# EasyEDA Pro project Mainboard.epro

# Schematic Schematic2

## Sheets
1 AUDIO: Board Name: Mainboard; Create Date: 2025-11-27; Page Name: AUDIO; Project Name: esp32PhoneV2-retry; Schematic Name: Schematic2; Update Date: 2025-12-29; Company: EasyEDA.com; Page Size: A4; Version: V1.0
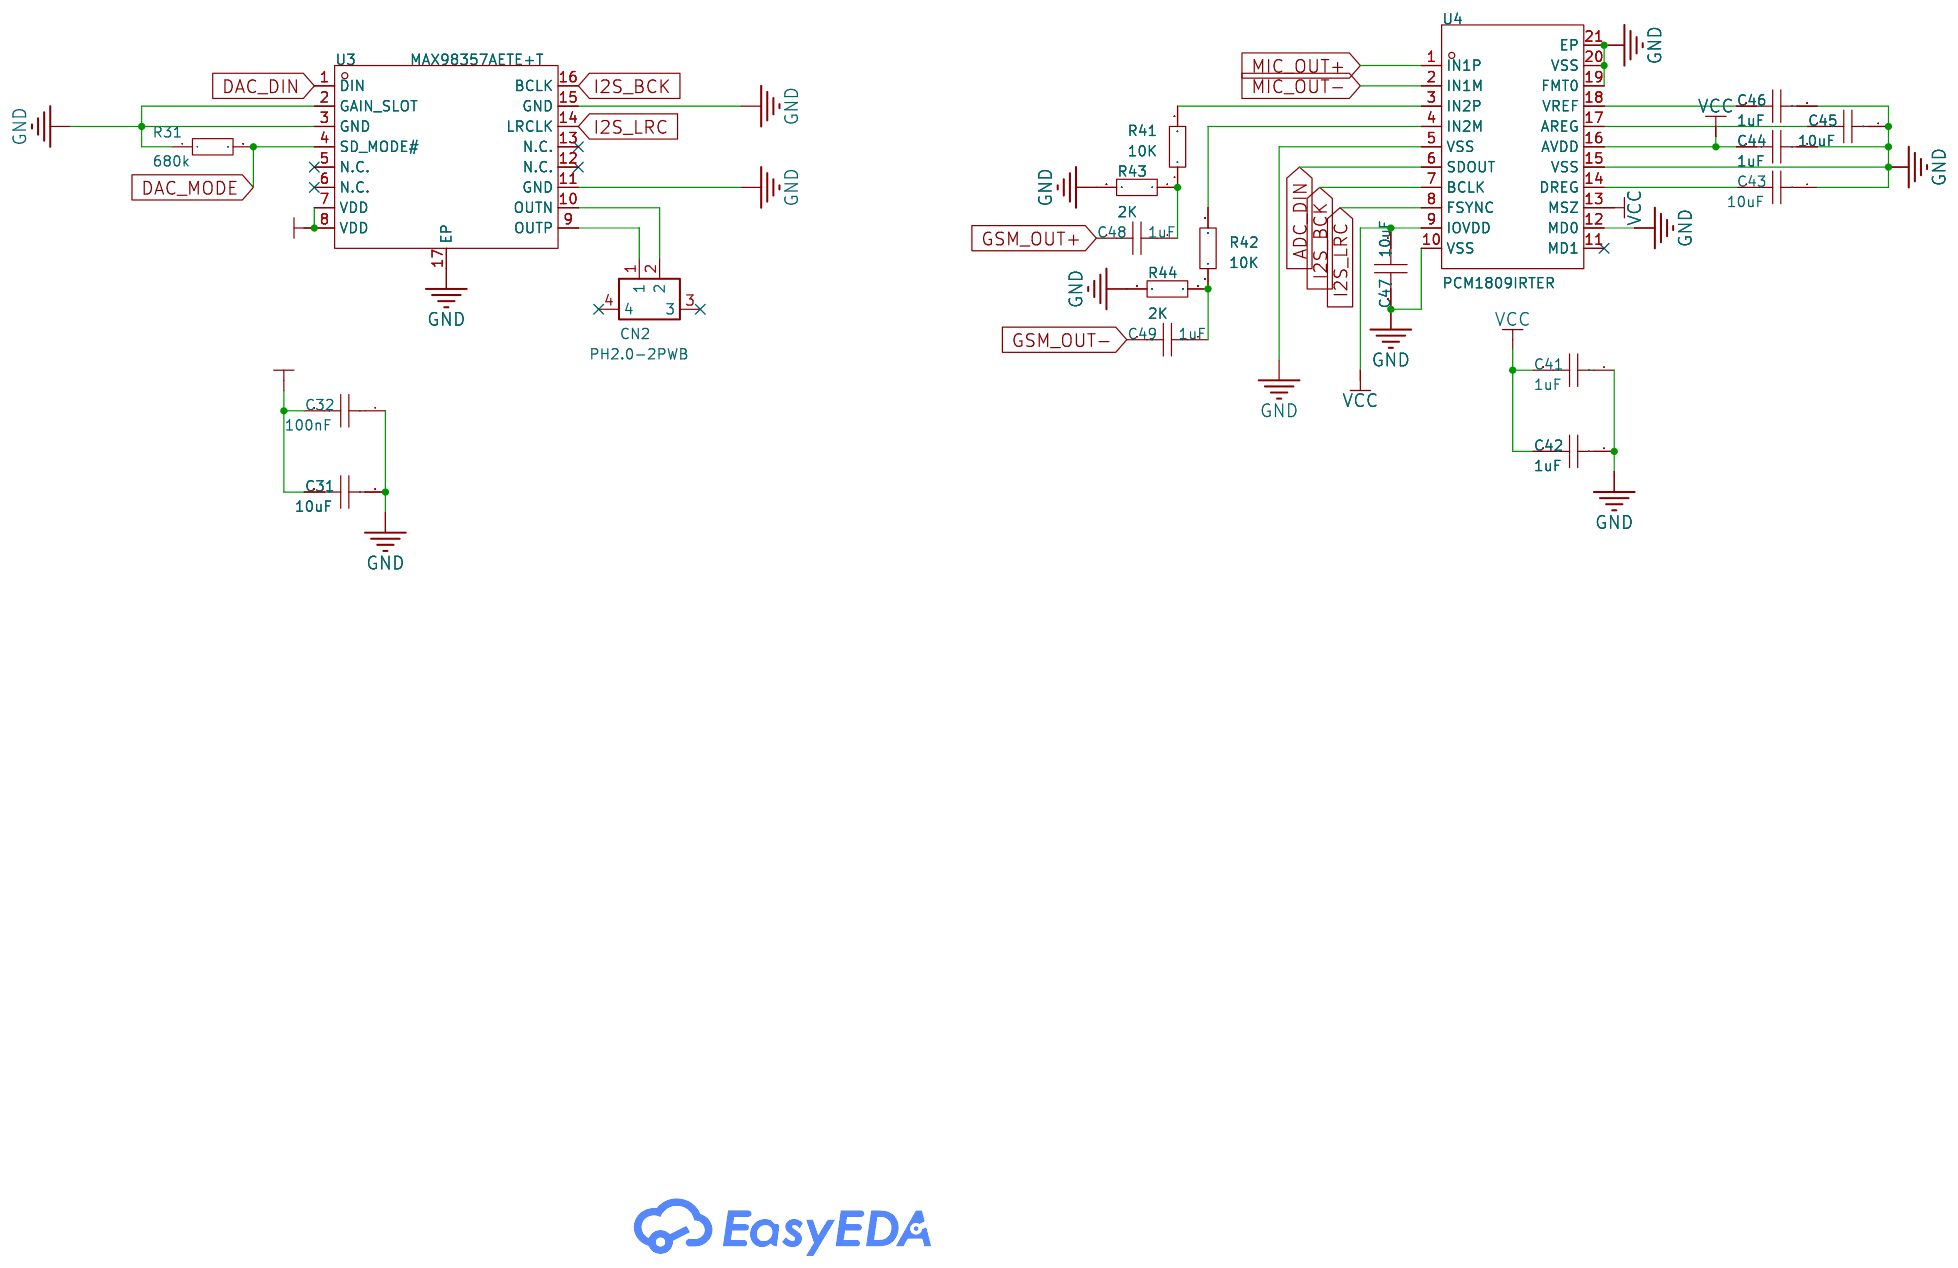
[diagram p0: AUDIO]
2 MAIN: Create Date: 2025-12-04; Page Name: MAIN
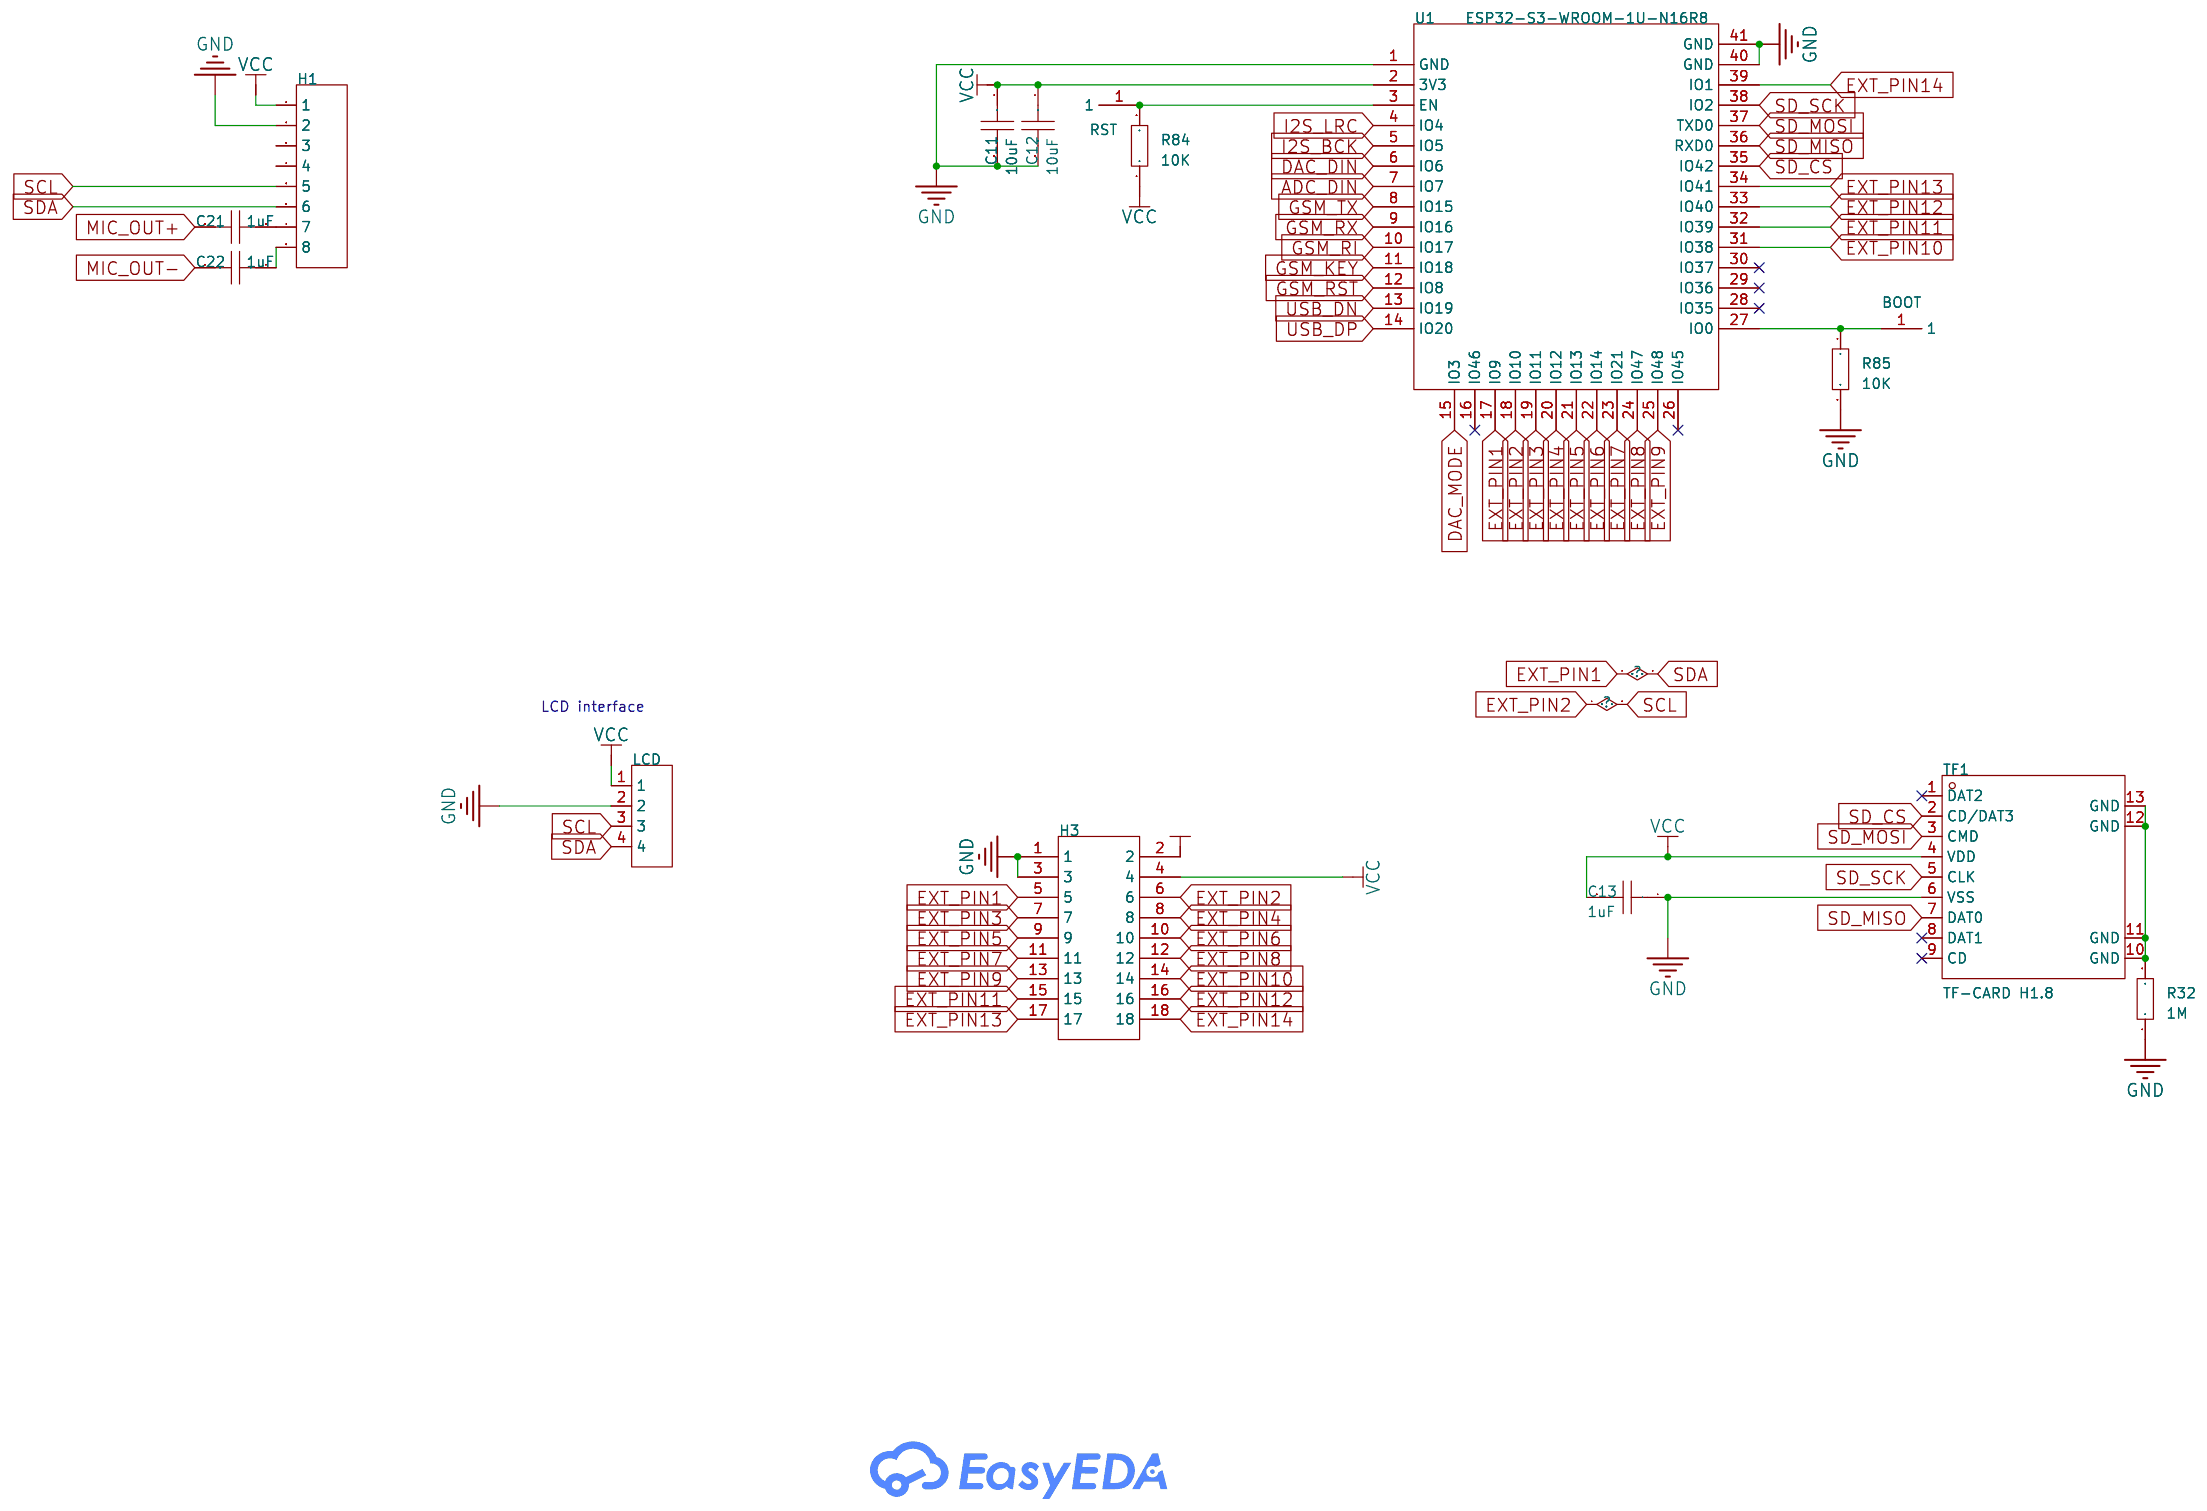
[diagram p1: MAIN]
3 GSM: Create Date: 2025-12-18; Page Name: GSM
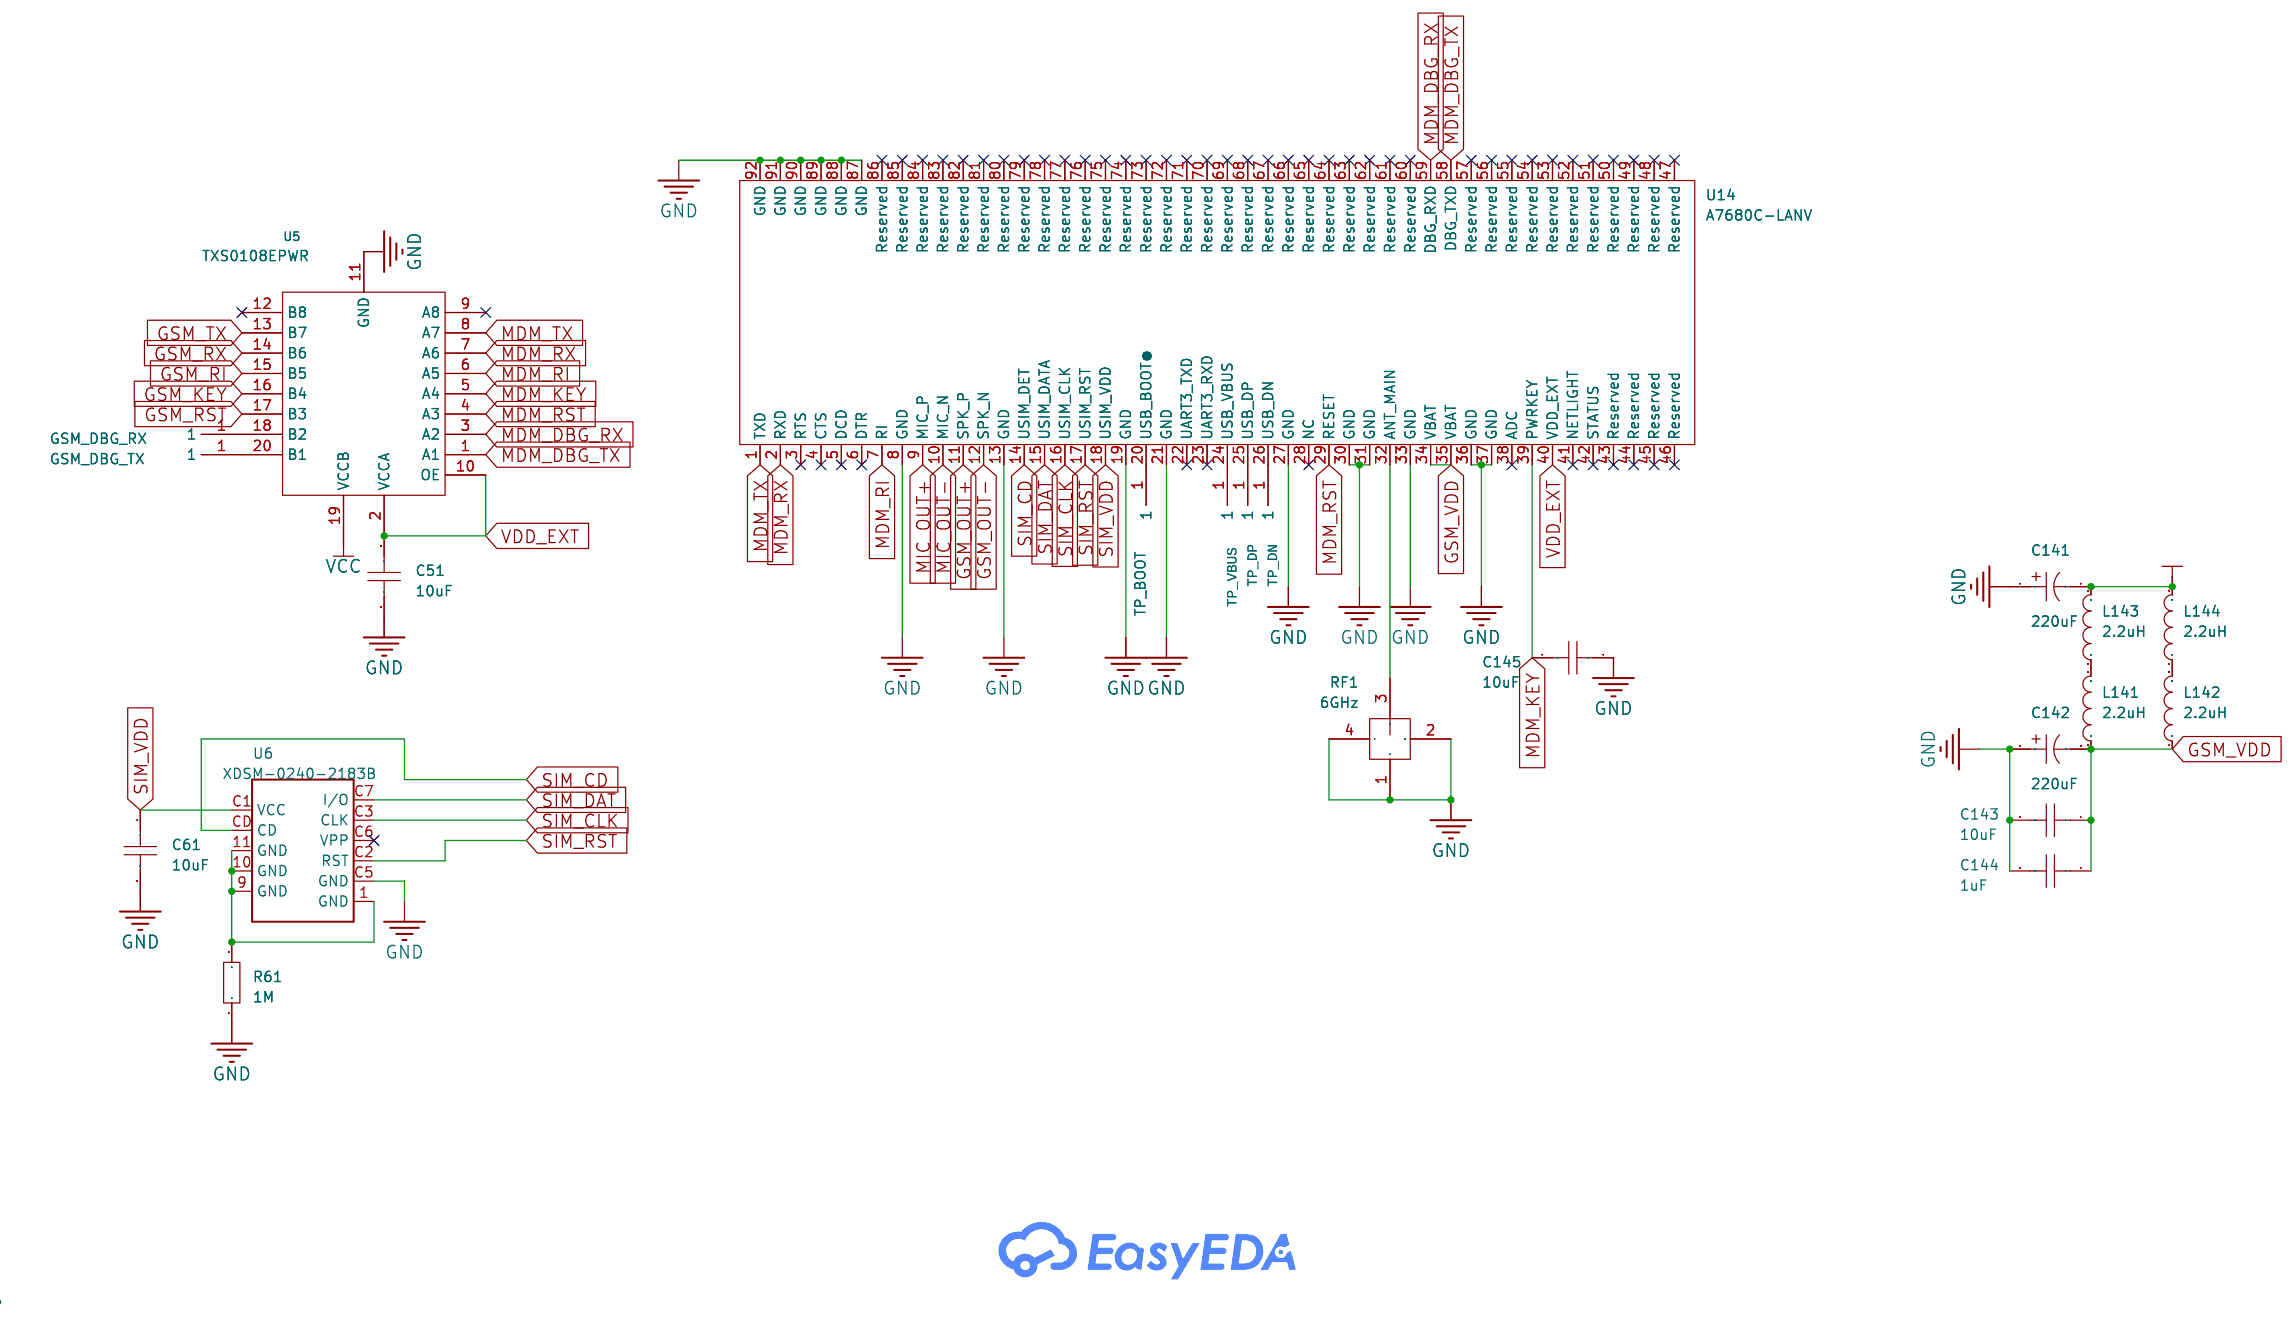
[diagram p2: GSM]
4 POWER: Create Date: 2025-12-19; Page Name: POWER
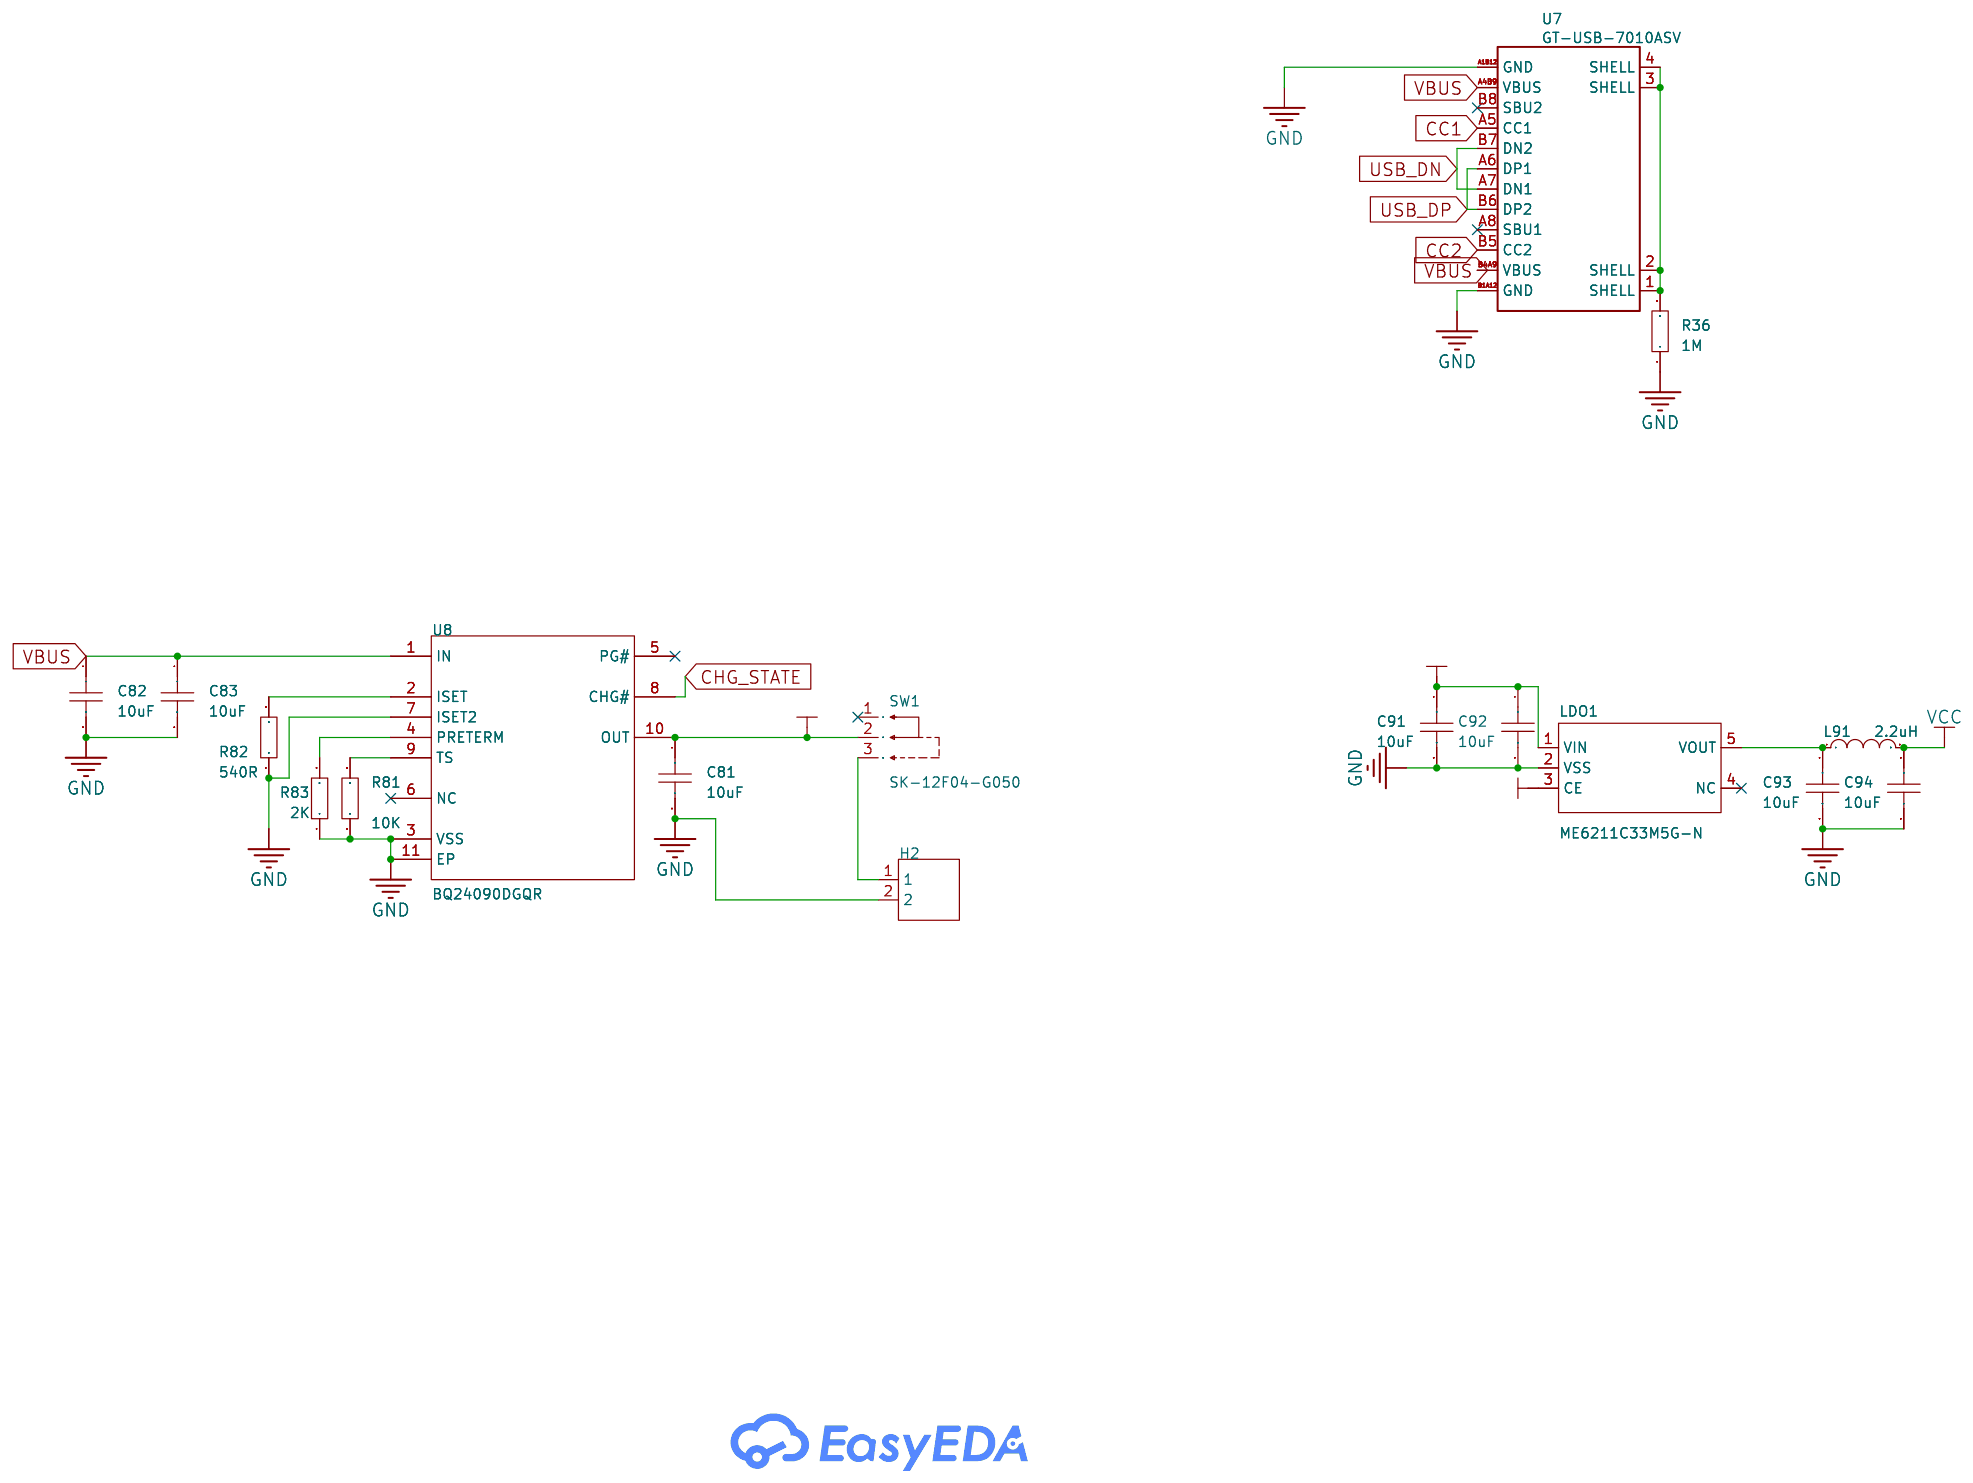
[diagram p3: POWER]

## Parts
sheet AUDIO
C31  10uF  [C0603]
C32  100nF  [C0603]
C41  1uF  [C0603]
C42  1uF  [C0603]
C43  10uF  [C0603]
C44  1uF  [C0603]
C45  10uF  [C0603]
C46  1uF  [C0603]
C47  10uF  [C0603]
C48  1uF  [C0603]
C49  1uF  [C0603]
CN2  PH2.0-2PWB  [CONN-SMD_2P-P2.00_PH2.0-SPWB]
R31  680k  [R0603]
R41  10K  [R0603]
R42  10K  [R0603]
R43  2K  [R0603]
R44  2K  [R0603]
U3  MAX98357AETE+T  [TQFN-16_L3.0-W3.0-P0.50-BL-EP1.5]
U4  PCM1809IRTER  [WQFN-20_L3.0-W3.0-P0.50-TL-EP1.4]
sheet GSM
C51  10uF  [C0603]
C61  10uF  [C0603]
C141  220uF  [CAP-SMD_L7.3-W4.3-FD]
C142  220uF  [CAP-SMD_L7.3-W4.3-FD]
C143  10uF  [C0603]
C144  1uF  [C0603]
C145  10uF  [C0603]
GSM_DBG_RX  -  [tp05R]
GSM_DBG_TX  -  [tp05R]
L141  2.2uH  [L1206]
L142  2.2uH  [L1206]
L143  2.2uH  [L1206]
L144  2.2uH  [L1206]
R61  1M  [R0603]
RF1  6GHz  [IPEX-SMD_4P-L1.7-W1.7-LS2.0-L-4]
TP_BOOT  -  [tp05R]
TP_DN  -  [tp05R]
TP_DP  -  [tp05R]
TP_VBUS  -  [tp05R]
U5  TXS0108EPWR  [TSSOP-20_L6.5-W4.4-P0.65-LS6.4-BL]
U6  XDSM-0240-2183B  [SIM-SMD_XDSM-0240-2183B]
U14  A7680C-LANV  [LCC-LAG_L17.6-W15.7_A7680C]
sheet MAIN
BOOT  -  [tp05R]
C11  10uF  [C0603]
C12  10uF  [C0603]
C13  1uF  [C0603]
C21  1uF  [C0603]
C22  1uF  [C0603]
H1  -  [HDR-TH_8P-P2.54-V-M]
H3  -  [HDR-TH_18P-P2.54-V-F-R2-C9-S2.54-1]
LCD  -  [HDR-TH_4P-P2.54-V-M]
R32  1M  [R0603]
R84  10K  [R0603]
R85  10K  [R0603]
RST  -  [tp05R]
TF1  TF-CARD H1.8  [TF-SMD_TF-CARD-H1.8]
U1  ESP32-S3-WROOM-1U-N16R8  [WIRELM-SMD_ESP32-S3-WROOM-1U]
sheet POWER
C81  10uF  [C0603]
C82  10uF  [C0603]
C83  10uF  [C0603]
C91  10uF  [C0603]
C92  10uF  [C0603]
C93  10uF  [C0603]
C94  10uF  [C0603]
H2  -  [HDR-TH_2P-P2.54-V-M-1]
L91  2.2uH  [L1206]
LDO1  ME6211C33M5G-N  [SOT-23-5_L3.0-W1.7-P0.95-LS2.8-BL]
R36  1M  [R0603]
R81  10K  [R0603]
R82  540R  [R0603]
R83  2K  [R0603]
SW1  SK-12F04-G050  [SW-TH_G-SWITCH_SK-12F04-G050]
U7  GT-USB-7010ASV  [USB-C-SMD_G-SWITCH_GT-USB-7010ASV]
U8  BQ24090DGQR  [MSOP-10_L3.0-W3.0-P0.50-LS5.0-BL-EP]

## Library data of the parts
C11-C13 C21 C22 C31 C32 C41-C49 C51 C61 C81-C83 C91-C94 C143-C145 = CAP_0603: Supplier Footprint: 0603
CN2 = PH2.0-2PWB: Supplier: LCSC; Manufacturer: BOOMELE(博穆精密); Manufacturer Part: PH-2P卧贴; Supplier Part: C47647; JLCPCB Part Class: Extended Part; spicePre: C
R31 R32 R36 R41-R44 R61 R81-R85 = Res_0603: Supplier Footprint: 0603
U3 = MAX98357AETE+T: Class:Class D Speaker Channels:- Output Power:3.2W×1@4Ω Voltage - Supply:2.5V~5.5V Voltage - Supply:2.5V~5.5V Total Harmonic Distortion + Noise (THD+N):- Quiescent Current:2.4mA Operating Temperature:-40℃~+85℃ Operating Temperature:-40℃~+85℃ Power Supply; LCSC Part Name: 微型、低成本、PCM 类 D 级放大器具有 AB 级性能; Supplier Part: C910544; Manufacturer: ADI(亚德诺)/MAXIM(美信); Supplier Footprint: TQFN-16-EP(3x3); JLCPCB Part Class: Extended Part; Datasheet: https://item.szlcsc.com/datasheet/MAX98357AETE%252BT/978950.html; Supplier: LCSC; Class: Class D; Output Power: 3.2W×1@4Ω; Voltage - Supply: 2.5V~5.5V; Quiescent Current: 2.4mA; Operating Temperature: -40℃~+85℃; Power Supply Rejection Ratio (PSRR): 77dB; Efficiency: 92%
U4 = PCM1809IRTER: Resolution(Bits):32 Sampling Rate:8kHz number of channels:2 Voltage - Supply:3V~3.6V Voltage - Supply:3V~3.6V Interface:TDM；I2S differential input:Yes Operating Temperature:-40℃~+105℃ Operating Temperature:-40℃~+105℃ Signal-to-Noise Ratio:104dB Clock/Osci; LCSC Part Name: 立体声通道、动态范围音频ADC; Supplier Part: C38558044; Manufacturer: TI(德州仪器); Supplier Footprint: WQFN-20-EP(3x3); JLCPCB Part Class: Extended Part; Datasheet: https://www.ti.com.cn/cn/lit/ds/symlink/pcm1809.pdf?ts=1738983100120&ref_url=https%253A%252F%252Fwww.ti.com.cn%252Fsitesearch%252Fzh-cn%252Fdocs%252Funiversalsearch.tsp%253FlangPref%253Dzh-CN%2526nr%253D5%2526searchTerm%253DPCM1809IRTER; Supplier: LCSC; Resolution(Bits): 32; Sampling Rate: 8kHz; number of channels: 2; Voltage - Supply: 3V~3.6V; Interface: TDM；I2S; differential input: Yes; Operating Temperature: -40℃~+105℃; Signal-to-Noise Ratio: 104dB; Clock/Oscillator: Built-In; Clock Frequency: 24.576MHz; Voltage Reference: Built-In; ADC architecture: Sigma-Delta; Quiescent Current (Iq): 500uA; Full-Scale Range(FSR): 2V
C141 C142 = TPSD227K010R0100: Capacitance:220uF Tolerance:±10% Tolerance:±10% Voltage Rating:10V Current - Leakage:- Ripple Current:- Equivalent Series Resistance(ESR):100mΩ Operating Temperature:-55℃~+125℃ Operating Temperature:-55℃~+125℃; LCSC Part Name: 220uF ±10% 10V; Supplier Part: C2764452; Manufacturer: Kyocera AVX; Supplier Footprint: CASE-D-7343-31(mm); JLCPCB Part Class: Extended Part; Supplier: LCSC; Tolerance: ±10%; Voltage Rating: 10V; Equivalent Series Resistance(ESR): 100mΩ; Operating Temperature: -55℃~+125℃
BOOT GSM_DBG_RX GSM_DBG_TX RST TP_BOOT TP_DN TP_DP TP_VBUS = testpoint05R
L91 L141-L144 = MGFL3216F2R2MT-LF: Inductance:2.2uH Tolerance:±20% Tolerance:±20% Current Rating:1.3A Current - Saturation (Isat):- DC Resistance(DCR):150mΩ Q @ Frequency:- Frequency - Self Resonant:- Ratings:-; LCSC Part Name: 2.2uH ±20%; Supplier Part: C486337; Manufacturer: microgate(麦捷科技); Supplier Footprint: 1206; JLCPCB Part Class: Extended Part; Datasheet: https://item.szlcsc.com/datasheet/MGFL3216F2R2MT-LF/494810.html; Supplier: LCSC; Tolerance: ±20%; Current Rating: 1.3A; DC Resistance(DCR): 150mΩ
RF1 = IPEX-3: Connector Type:Board Side Interface:Male Pin Number of Ports:1 Interface Diameter:1.4mm Interface Length/Height:0.85mm Frequency:6GHz RF Series:IPEX Impedance:50Ω Rated Voltage (Max):60V Operating Temperature Range:-40℃~+85℃ Operating Temperature Range:-4; LCSC Part Name: 内针 IPEX; Supplier Part: C47986641; Manufacturer: HanElectricity(瀚源); Supplier Footprint: SMD; JLCPCB Part Class: Extended Part; Datasheet: https://item.szlcsc.com/datasheet/IPEX-3/50223058.html; Supplier: LCSC; Connector Type: Board Side; Interface: Male Pin; Number of Ports: 1; Interface Diameter: 1.4mm; Interface Length/Height: 0.85mm; RF Series: IPEX; Impedance: 50Ω; Rated Voltage (Max): 60V; Operating Temperature Range: -40℃~+85℃
U5 = TXS0108EPWR: Channel Type:Bidirectional Input Signal:- Output Signal:- Data Rate:60Mbps Voltage - Supply(VCCA):1.4V~3.6V Voltage - Supply(VCCA):1.4V~3.6V Voltage - Supply(VCCB):1.65V~5.5V Voltage - Supply(VCCB):1.65V~5.5V Number of Circuits:1 Number of Circuits:8 Outp; LCSC Part Name: 60Mbps 8位双向电平转换器; Supplier Part: C17206; Manufacturer: TI(德州仪器); Supplier Footprint: TSSOP-20; JLCPCB Part Class: Extended Part; Datasheet: http://www.ti.com/cn/lit/gpn/txs0108e; Supplier: LCSC; Channel Type: Bidirectional; Data Rate: 60Mbps; Voltage - Supply(VCCA): 1.4V~3.6V; Voltage - Supply(VCCB): 1.65V~5.5V; Number of Circuits: 8; Output Type: Open Drain；Push-pull; Operating Temperature: -40℃~+85℃; Features: Automatic Direction Detection
U6 = XDSM-0240-2183B: Supplier: LCSC; Supplier Part: C7498090; Manufacturer: LX(连欣科技); JLCPCB Part Class: Extended Part; Contributor: lcsc; spicePre: U
U14 = A7680C-LANV: Supplier Part: C5381968; Manufacturer: SIMCOM(芯讯通无线科技); Supplier Footprint: LCC-LGA; JLCPCB Part Class: Extended Part; Datasheet: https://item.szlcsc.com/datasheet/A7680C-LANV/6252671.html; Supplier: LCSC
H1 = HDR-M_2.54_1x8P: Supplier Footprint: Through
H3 = HDR-F_2.54_2x9: Supplier Footprint: Through
LCD = HDR-M_2.54_1x4P: Supplier Footprint: Through
TF1 = TF-CARD H1.8: Card Connection Mode:Push-Push Card Type:MicroSD Card (TF Card) Connector Type:Connector and Ejector Additional Card Detection Pins:- Supplementary Features:- Height Above Board:1.8mm Operating Temperature:-40℃~+70℃ Operating Temperature:-40℃~+70℃; LCSC Part Name: 自弹式 MicroSD卡(TF卡) 卡座; Supplier Part: C7529389; Manufacturer: SHOU HAN(首韩); Supplier Footprint: SMD; JLCPCB Part Class: Extended Part; Datasheet: https://item.szlcsc.com/datasheet/TF-CARD%2520H1.8/8629776.html; Supplier: LCSC; Card Connection Mode: Push-Push; Card Type: MicroSD Card (TF Card); Connector Type: Connector and Ejector; Height Above Board: 1.8mm; Operating Temperature: -40℃~+70℃
U1 = ESP32-S3-WROOM-1U-N16R8: Supplier Part: C3013946; Manufacturer: ESPRESSIF(乐鑫); Supplier Footprint: SMD,19.2x18mm; JLCPCB Part Class: Extended Part; Datasheet: https://item.szlcsc.com/datasheet/ESP32-S3-WROOM-1U-N16R8/3522416.html; Supplier: LCSC
H2 = HDR-M_2.54_1x2P: Supplier Footprint: Through
LDO1 = ME6211C33M5G-N: Output Type:Fixed Voltage - Supply:6V Output Voltage:3.3V Output Voltage:3.3V Output Current:500mA Power Supply Rejection Ratio (PSRR):70dB@(1kHz) Voltage Dropout:120mV@(100mA) standby current:60uA Noise:50uVrms Features:Over Current Protection；Enable；Sho; LCSC Part Name: 输入6V 输出3.3V 500mA; Supplier Part: C82942; Manufacturer: MICRONE(南京微盟); Supplier Footprint: SOT-23-5; JLCPCB Part Class: Extended Part; Datasheet: https://item.szlcsc.com/datasheet/ME6211C33M5G-N/84106.html; Supplier: LCSC; Output Type: Fixed; Voltage - Supply: 6V; Output Voltage: 3.3V; Output Current: 500mA; Power Supply Rejection Ratio (PSRR): 70dB@(1kHz); Voltage Dropout: 120mV@(100mA); standby current: 60uA; Noise: 50uVrms; Features: Over Current Protection；Enable；Short Circuit Protection; Operating Temperature: -40℃~+150℃; Output Configuration: Positive; Number of Outputs: 1
SW1 = SK-12F04-G050: Circuit:SPDT Actuator Style:Rectangular Columnar Termination Style:PC Pin Length:12.2mm Width:4.9mm Switch Height:10.6mm Mounting Type:Right Angle Actuator Color:Black Current Rating:1A Voltage Rating:24V Life:10,000 Cycles Operating Temperature:-25℃~+70℃; LCSC Part Name: 柄长5mm 卧插两档 滑动开关; Supplier Part: C2848876; Manufacturer: G-Switch(品赞); Supplier Footprint: 弯插,12.2x4.9mm; JLCPCB Part Class: Extended Part; Datasheet: https://item.szlcsc.com/datasheet/SK-12F04-G050/3048225.html; Supplier: LCSC; Circuit: SPDT; Actuator Style: Rectangular Columnar; Termination Style: PC Pin; Length: 12.2mm; Width: 4.9mm; Switch Height: 10.6mm; Mounting Type: Right Angle; Actuator Color: Black; Current Rating: 1A; Voltage Rating: 24V; Life: 10,000 Cycles; Operating Temperature: -25℃~+70℃
U7 = GT-USB-7010ASV: Supplier: LCSC; Supplier Part: C2988369; Manufacturer: G-Switch(品赞); JLCPCB Part Class: Extended Part; Contributor: lcsc; spicePre: U
U8 = BQ24090DGQR: The Chip Type:Charging IC Voltage - Supply:4.45V~6.45V Voltage - Supply:4.45V~6.45V Charge Current - Max:1A Charging Saturation Voltage:4.2V Type of Battery:Lithium Battery Number of Cells:1 Number of Cells:1 Operating Temperature:0℃~+125℃ Operating Tempe; LCSC Part Name: 1A单输入单节锂离子和锂聚合物电池充电器; Supplier Part: C43306; Manufacturer: TI(德州仪器); Supplier Footprint: MSOP-10-EP; JLCPCB Part Class: Extended Part; Datasheet: https://www.ti.com/cn/lit/gpn/bq24090; Supplier: LCSC; The Chip Type: Charging IC; Voltage - Supply: 4.45V~6.45V; Charge Current - Max: 1A; Charging Saturation Voltage: 4.2V; Type of Battery: Lithium Battery; Number of Cells: 1; Operating Temperature: 0℃~+125℃; Battery Temperature Detection: Support; 0V Battery Charge: Support; Supply Current (Iq): 1mA

## Nets
4.2V: C31.2 C32.2 C81.1 C91.1 C92.1 C141.2 H3.2 L143.2 L144.2 LDO1.1(VIN) LDO1.3(CE) SW1.2 U3.7(VDD) U3.8(VDD) U8.10(OUT)
GND: C11.2 C12.2 C13.1 C31.1 C32.1 C41.1 C42.1 C43.1 C44.1 C45.1 C46.1 C47.2 C51.2 C61.2 C81.2 C82.2 C83.2 C91.2 C92.2 C93.2 C94.2 C141.1 C142.1 C143.2 C144.2 C145.1 H1.2 H2.2 H3.1 H3.3 LCD.2 LDO1.2(VSS) R31.1 R32.1 R36.1 R43.2 R44.1 R61.1 R81.1 R82.1 R83.1 R85.2 RF1.1 RF1.2 RF1.4 TF1.6(VSS) U1.1(GND) U1.40(GND) U1.41(GND) U3.2(GAIN_SLOT) U3.3(GND) U3.11(GND) U3.15(GND) U3.17(EP) U4.5(VSS) U4.10(VSS) U4.12(MD0) U4.15(VSS) U4.19(FMT0) U4.20(VSS) U4.21(EP) U5.11(GND) U6.C5(GND) U7.A1B12(GND) U7.B1A12(GND) U8.3(VSS) U8.7(ISET2) U8.11(EP) U14.8(GND) U14.13(GND) U14.19(GND) U14.21(GND) U14.27(GND) U14.30(GND) U14.31(GND) U14.33(GND) U14.36(GND) U14.37(GND) U14.87(GND) U14.88(GND) U14.89(GND) U14.90(GND) U14.91(GND) U14.92(GND)
VBUS: C82.1 C83.1 U7.A4B9(VBUS) U7.B4A9(VBUS) U8.1(IN)
VCC: C11.1 C12.1 C13.2 C41.2 C42.2 C44.2 C47.1 C94.1 H1.1 H3.4 L91.2 LCD.1 R84.1 TF1.4(VDD) U1.2(3V3) U4.9(IOVDD) U4.13(MSZ) U4.16(AVDD) U5.19(VCCB)
VDD_EXT: C51.1 U5.2(VCCA) U5.10(OE) U14.40(VDD_EXT)
ADC_DIN: U1.7(IO7) U4.6(SDOUT)
CC1: U7.A5(CC1)
CC2: U7.B5(CC2)
CHG_STATE: U8.8(CHG#)
DAC_DIN: U1.6(IO6) U3.1(DIN)
DAC_MODE: R31.2 U1.15(IO3) U3.4(SD_MODE#)
EXT_PIN1: H1.6 H3.5 LCD.4 U1.17(IO9)
EXT_PIN2: H1.5 H3.6 LCD.3 U1.18(IO10)
EXT_PIN3: H3.7 U1.19(IO11)
EXT_PIN4: H3.8 U1.20(IO12)
EXT_PIN5: H3.9 U1.21(IO13)
EXT_PIN6: H3.10 U1.22(IO14)
EXT_PIN7: H3.11 U1.23(IO21)
EXT_PIN8: H3.12 U1.24(IO47)
EXT_PIN9: H3.13 U1.25(IO48)
EXT_PIN10: H3.14 U1.31(IO38)
EXT_PIN11: H3.15 U1.32(IO39)
EXT_PIN12: H3.16 U1.33(IO40)
EXT_PIN13: H3.17 U1.34(IO41)
EXT_PIN14: H3.18 U1.39(IO1)
GSM_KEY: U1.11(IO18) U5.16(B4)
GSM_OUT+: C48.2 U14.11(SPK_P)
GSM_OUT-: C49.2 U14.12(SPK_N)
GSM_RI: U1.10(IO17) U5.15(B5)
GSM_RST: U1.12(IO8) U5.17(B3)
GSM_RX: U1.9(IO16) U5.14(B6)
GSM_TX: U1.8(IO15) U5.13(B7)
GSM_VDD: C142.2 C143.1 C144.1 L141.1 L142.1 U14.34(VBAT) U14.35(VBAT)
I2S_BCK: U1.5(IO5) U3.16(BCLK) U4.7(BCLK)
I2S_LRC: U1.4(IO4) U3.14(LRCLK) U4.8(FSYNC)
MDM_DBG_RX: U5.3(A2) U14.59(DBG_RXD)
MDM_DBG_TX: U5.1(A1) U14.58(DBG_TXD)
MDM_KEY: C145.2 U5.5(A4) U14.39(PWRKEY)
MDM_RI: U5.6(A5) U14.7(RI)
MDM_RST: U5.4(A3) U14.29(RESET)
MDM_RX: U5.7(A6) U14.2(RXD)
MDM_TX: U5.8(A7) U14.1(TXD)
MIC_OUT+: C21.2 U4.1(IN1P) U14.9(MIC_P)
MIC_OUT-: C22.2 U4.2(IN1M) U14.10(MIC_N)
SD_CS: TF1.2(CD/DAT3) U1.35(IO42)
SD_MISO: TF1.7(DAT0) U1.36(RXD0)
SD_MOSI: TF1.3(CMD) U1.37(TXD0)
SD_SCK: TF1.5(CLK) U1.38(IO2)
SIM_CD: U6.CD U14.14(USIM_DET)
SIM_CLK: U6.C3(CLK) U14.16(USIM_CLK)
SIM_DAT: U6.C7(I/O) U14.15(USIM_DATA)
SIM_RST: U6.C2(RST) U14.17(USIM_RST)
SIM_VDD: C61.1 U6.C1(VCC) U14.18(USIM_VDD)
USB_DN: U1.13(IO19) U7.A7(DN1) U7.B7(DN2)
USB_DP: U1.14(IO20) U7.A6(DP1) U7.B6(DP2)
$1N627: R41.2 U4.3(IN2P)
$1N640: R42.2 U4.4(IN2M)
$1N1240: C46.2 U4.18(VREF)
$1N1281: C45.2 U4.17(AREG)
$1N1917: CN2.1 U3.9(OUTP)
$1N1922: CN2.2 U3.10(OUTN)
$1N1987: C43.2 U4.14(DREG)
$1N3244: C49.1 R42.1 R44.2
$1N3252: C48.1 R41.1 R43.1
$3N2541: R32.2 TF1.10(GND) TF1.11(GND) TF1.12(GND) TF1.13(GND)
$3N4160: C22.1 H1.8
$3N4212: C21.1 H1.7
$3N6525: R84.2 RST.1 U1.3(EN)
$3N6717: BOOT.1 R85.1 U1.27(IO0)
$4N1300: R61.2 U6.1(GND) U6.9(GND) U6.10(GND) U6.11(GND)
$4N2254: L141.2 L143.1
$4N2294: L142.2 L144.1
$4N3518: RF1.3 U14.32(ANT_MAIN)
$4N4563: TP_BOOT.1 U14.20(USB_BOOT●)
$4N4643: TP_VBUS.1 U14.24(USB_VBUS)
$4N4664: TP_DP.1 U14.25(USB_DP)
$4N4685: TP_DN.1 U14.26(USB_DN)
$4N6666: GSM_DBG_RX.1 U5.18(B2)
$4N6668: GSM_DBG_TX.1 U5.20(B1)
$5N380: R36.2 U7.1(SHELL) U7.2(SHELL) U7.3(SHELL) U7.4(SHELL)
$5N1031: R82.2 U8.2(ISET)
$5N1617: R81.2 U8.9(TS)
$5N1677: R83.2 U8.4(PRETERM)
$5N1951: H2.1 SW1.3
$5N2171: C93.1 L91.1 LDO1.5(VOUT)

Not connected (* = marked no-connect by the designer): CN2 3* 4*; H1 3 4; LDO1 4(NC)*; SW1 1*; TF1 1(DAT2)* 8(DAT1)* 9(CD)*; U1 16(IO46)* 26(IO45)* 28(IO35)* 29(IO36)* 30(IO37)*; U3 5(N.C.)* 6(N.C.)* 12(N.C.)* 13(N.C.)*; U4 11(MD1)*; U5 9(A8)* 12(B8)*; U6 C6(VPP)*; U7 A8(SBU1)* B8(SBU2)*; U8 5(PG#)* 6(NC)*; U14 3(RTS)* 4(CTS)* 5(DCD)* 6(DTR)* 22(UART3_TXD)* 23(UART3_RXD)* 28(NC)* 38(ADC)* 41(NETLIGHT)* 42(STATUS)* 43(Reserved)* 44(Reserved)* 45(Reserved)* 46(Reserved)* 47(Reserved)* 48(Reserved)* 49(Reserved)* 50(Reserved)* 51(Reserved)* 52(Reserved)* 53(Reserved)* 54(Reserved)* 55(Reserved)* 56(Reserved)* 57(Reserved)* 60(Reserved)* 61(Reserved)* 62(Reserved)* 63(Reserved)* 64(Reserved)* 65(Reserved)* 66(Reserved)* 67(Reserved)* 68(Reserved)* 69(Reserved)* 70(Reserved)* 71(Reserved)* 72(Reserved)* 73(Reserved)* 74(Reserved)* 75(Reserved)* 76(Reserved)* 77(Reserved)* 78(Reserved)* 79(Reserved)* 80(Reserved)* 81(Reserved)* 82(Reserved)* 83(Reserved)* 84(Reserved)* 85(Reserved)* 86(Reserved)*

## Notes on the sheets
sheet 2
- LCD interface

# Board PCB4
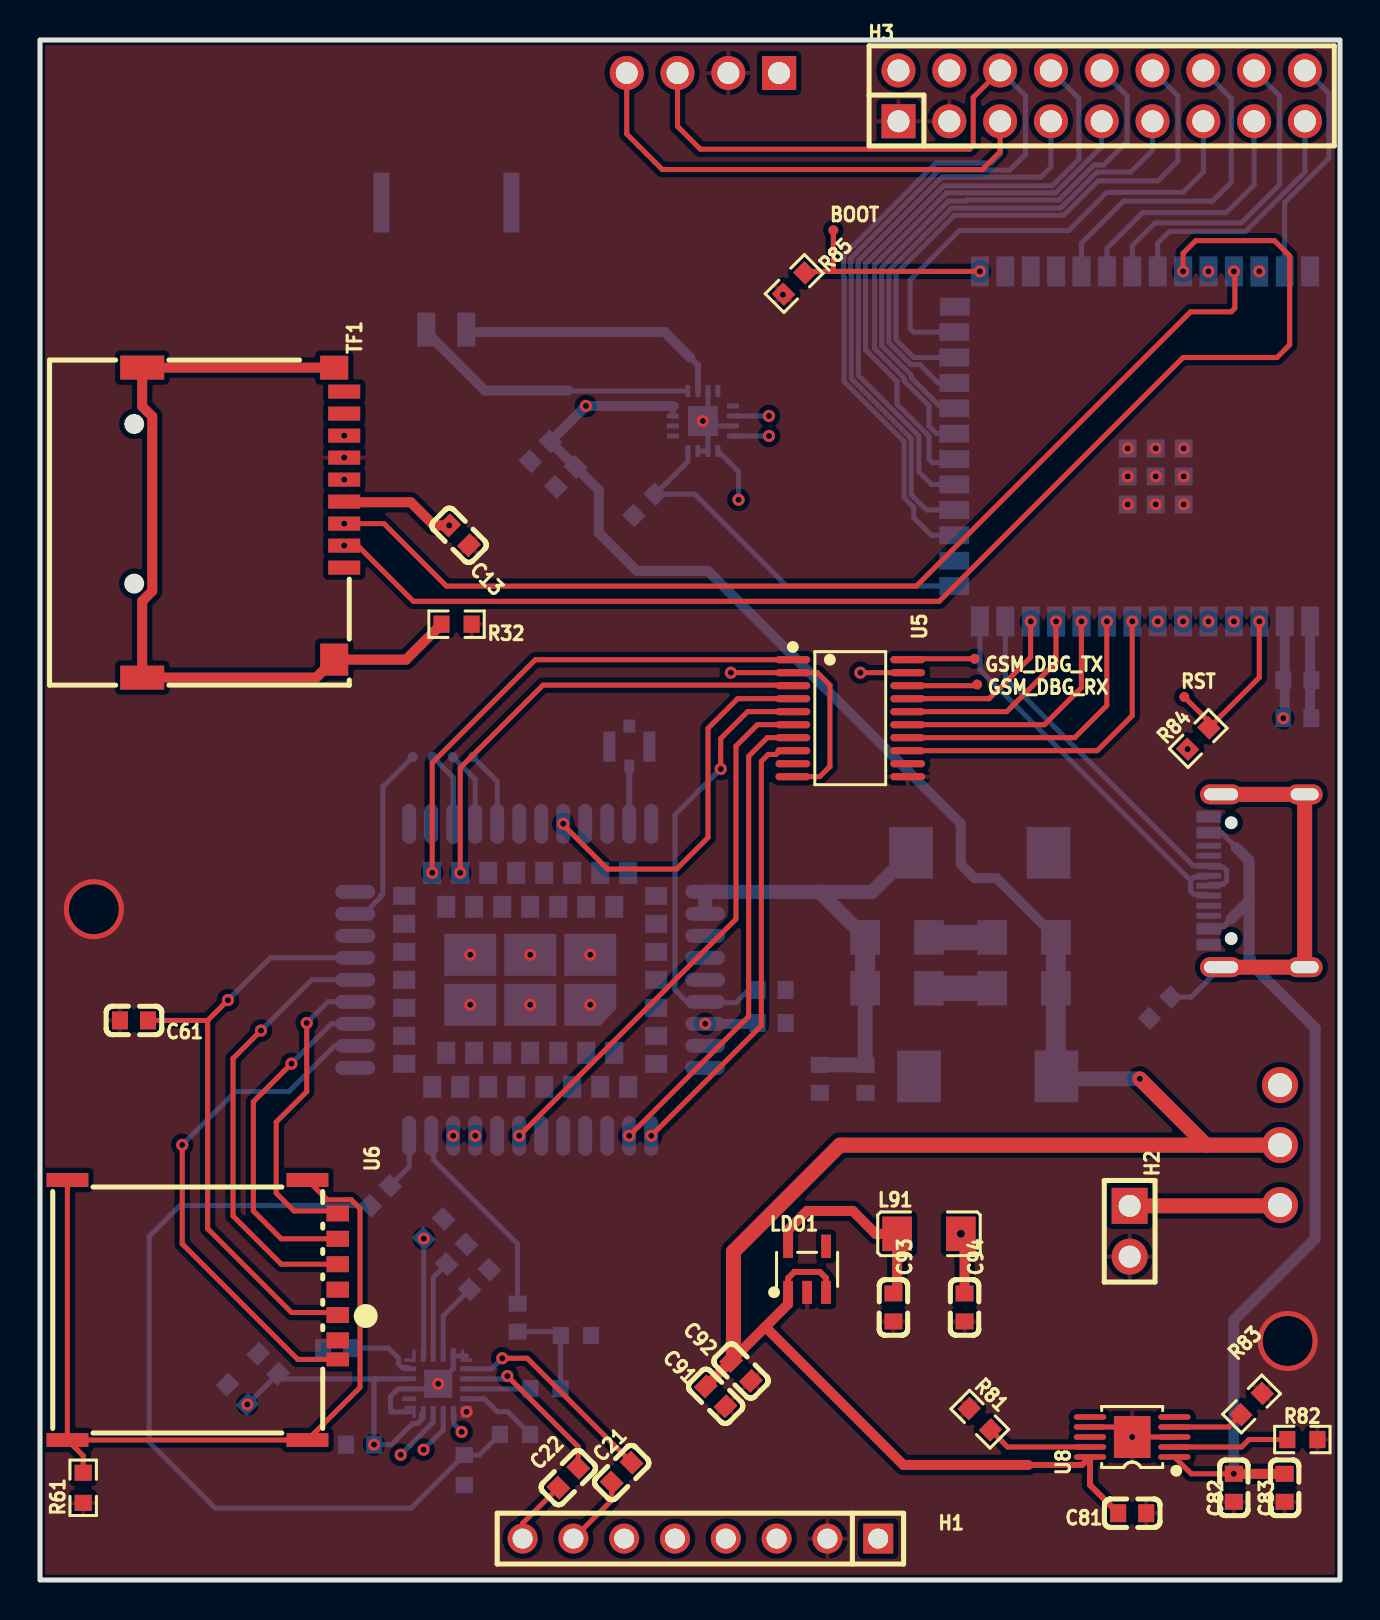
[diagram p4: board, top side]
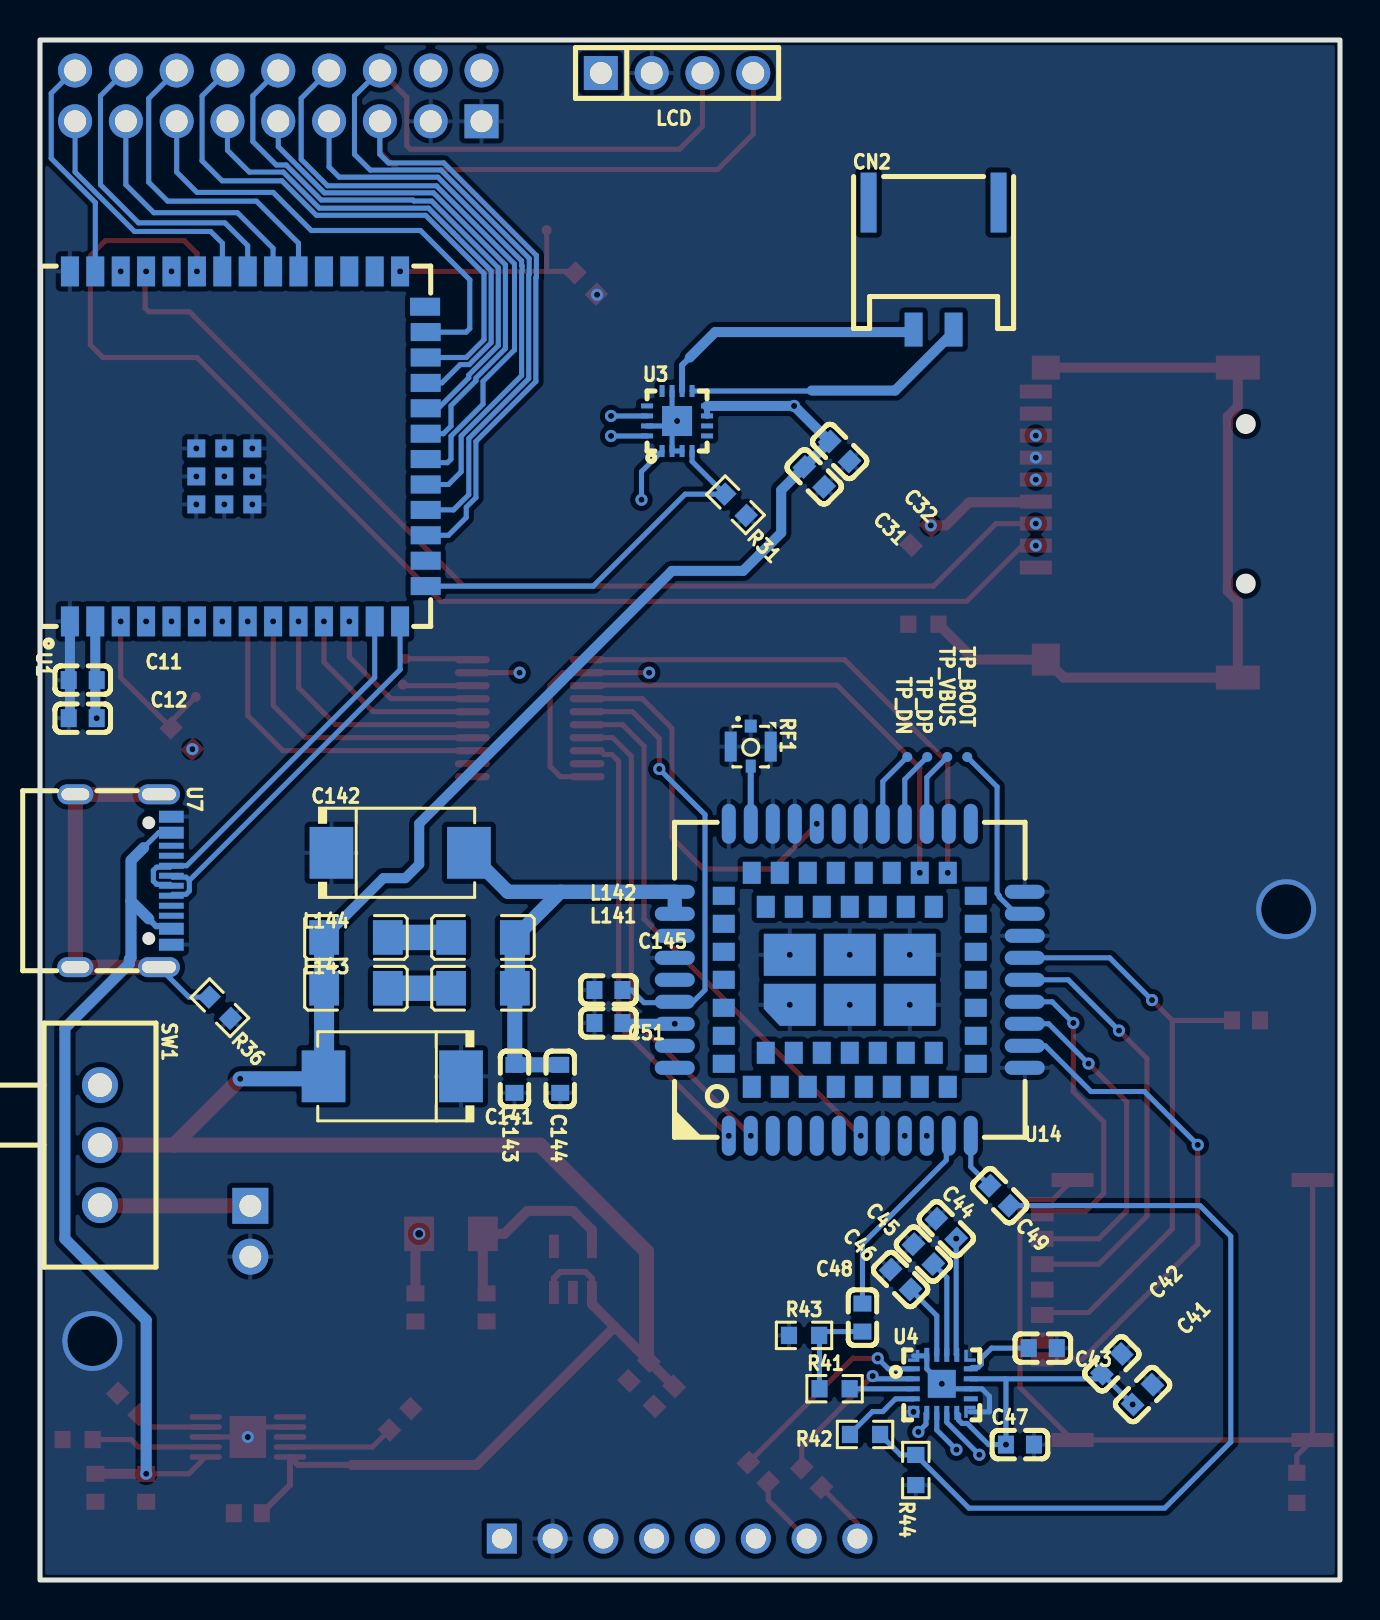
[diagram p5: board, bottom side, seen from below]

Outline 65 x 77 mm; copper layers: Top Layer, Inner1, Inner2, Bottom Layer. Coordinates in mm from the lower left corner of the outline.
Outline path: rectangle 0,77 65,0
Stack: Top Layer 0.035mm Outer layer thickness 1oz / Dielectric1 0.2104mm 7628 RC49% 8.6mil / Inner1 0.0152mm Inner layer thickness / Dielectric2 1.065mm 1.1mm H/HOZ Copper / Inner2 0.0152mm Inner layer thickness / Dielectric3 0.2104mm 7628 RC49% 8.6mil / Bottom Layer 0.035mm Outer layer thickness 1oz

## Design rules (mm)
template: JLCPCB Capability(Two Layers Board)
spacing copperThickness1oz (default): track to track 0.102, other pairs 0.152 to 0.3
spacing copperThickness2oz: track to track 0.203, other pairs 0.152 to 0.3
track width copperThickness1oz (default): min 0.127, default 0.254, max 2.54
track width copperThickness2oz: min 0.203, default 0.254, max 2.54
differential pair differentialPair (default): width min 0.127, default 0.254, max 2.54; gap min 0.152, default 0.152
via viaSize (default): diameter min 0.5, default 0.61, max 10; hole min 0.3, default 0.305, max 6.3

## Placement (name value [footprint] x y rotation side)
BOOT  -  [tp05R]  39.67 67.49 0 top
C11  10uF  [C0603]  62.87 45 0 bottom
C12  10uF  [C0603]  62.87 43.09 0 bottom
C13  1uF  [C0603]  20.96 52.23 135 top
C21  1uF  [C0603]  29.08 5.37 45 top
C22  1uF  [C0603]  26.42 5.12 45 top
C31  10uF  [C0603]  26.29 55.16 45 bottom
C32  100nF  [C0603]  25.02 56.43 45 bottom
C41  1uF  [C0603]  9.87 9.27 315 bottom
C42  1uF  [C0603]  11.41 10.81 315 bottom
C43  10uF  [C0603]  14.86 11.59 0 bottom
C44  1uF  [C0603]  19.69 17.56 225 bottom
C45  10uF  [C0603]  20.83 16.29 225 bottom
C46  1uF  [C0603]  21.97 15.02 225 bottom
C47  10uF  [C0603]  16 6.77 180 bottom
C48  1uF  [C0603]  23.88 13.12 90 bottom
C49  1uF  [C0603]  17.02 19.22 45 bottom
C51  10uF  [C0603]  36.58 27.85 0 bottom
C61  10uF  [C0603]  4.7 27.98 180 top
C81  10uF  [C0603]  54.61 3.34 0 top
C82  10uF  [C0603]  59.69 4.61 270 top
C83  10uF  [C0603]  62.23 4.61 270 top
C91  10uF  [C0603]  33.78 9.18 315 top
C92  10uF  [C0603]  35.05 10.45 315 top
C93  10uF  [C0603]  42.67 13.63 270 top
C94  10uF  [C0603]  46.23 13.63 270 top
C141  220uF  [CAP-SMD_L7.3-W4.3-FD]  47.39 25.18 0 bottom
C142  220uF  [CAP-SMD_L7.3-W4.3-FD]  46.99 36.36 180 bottom
C143  10uF  [C0603]  41.28 25.06 270 bottom
C144  1uF  [C0603]  38.99 25.06 270 bottom
C145  10uF  [C0603]  36.58 29.5 180 bottom
CN2  PH2.0-2PWB  [CONN-SMD_2P-P2.00_PH2.0-SPWB]  20.32 65.7 180 bottom
GSM_DBG_RX  -  [tp05R]  46.86 44.77 180 top
GSM_DBG_TX  -  [tp05R]  46.73 46.06 180 top
H1  -  [HDR-TH_8P-P2.54-V-M]  33.02 2.07 180 top
H2  -  [HDR-TH_2P-P2.54-V-M-1]  54.48 17.44 270 top
H3  -  [HDR-TH_18P-P2.54-V-F-R2-C9-S2.54-1]  53.09 74.21 0 top
L91  2.2uH  [L1206]  44.45 17.31 0 top
L141  2.2uH  [L1206]  42.85 29.59 0 bottom
L142  2.2uH  [L1206]  42.85 32.13 0 bottom
L143  2.2uH  [L1206]  49.2 29.59 0 bottom
L144  2.2uH  [L1206]  49.2 32.13 0 bottom
LCD  -  [HDR-TH_4P-P2.54-V-M]  33.15 75.35 180 bottom
LDO1  ME6211C33M5G-N  [SOT-23-5_L3.0-W1.7-P0.95-LS2.8-BL]  38.35 15.53 0 top
R31  680k  [R0603]  30.23 53.76 45 bottom
R32  1M  [R0603]  20.83 47.79 180 top
R36  1M  [R0603]  56.01 28.61 45 bottom
R41  10K  [R0603]  25.27 9.56 180 bottom
R42  10K  [R0603]  23.75 7.28 0 bottom
R43  2K  [R0603]  26.8 12.23 0 bottom
R44  2K  [R0603]  21.21 5.5 90 bottom
R61  1M  [R0603]  2.16 4.61 90 top
R81  10K  [R0603]  46.99 8.04 315 top
R82  540R  [R0603]  63.12 7.02 180 top
R83  2K  [R0603]  60.58 8.8 225 top
R84  10K  [R0603]  57.91 42.08 45 top
R85  10K  [R0603]  37.71 64.82 225 top
RF1  6GHz  [IPEX-SMD_4P-L1.7-W1.7-LS2.0-L-4]  29.46 41.69 270 bottom
RST  -  [tp05R]  57.21 44.15 0 top
SW1  SK-12F04-G050  [SW-TH_G-SWITCH_SK-12F04-G050]  62 21.75 270 bottom
TF1  TF-CARD H1.8  [TF-SMD_TF-CARD-H1.8]  10.16 52.87 270 top
TP_BOOT  -  [tp05R]  18.64 41.15 180 bottom
TP_DN  -  [tp05R]  21.64 41.15 180 bottom
TP_DP  -  [tp05R]  20.64 41.15 180 bottom
TP_VBUS  -  [tp05R]  19.64 41.15 180 bottom
U1  ESP32-S3-WROOM-1U-N16R8  [WIRELM-SMD_ESP32-S3-WROOM-1U]  54.61 56.68 90 bottom
U3  MAX98357AETE+T  [TQFN-16_L3.0-W3.0-P0.50-BL-EP1.5]  33.15 57.95 180 bottom
U4  PCM1809IRTER  [WQFN-20_L3.0-W3.0-P0.50-TL-EP1.4]  19.91 9.81 180 bottom
U5  TXS0108EPWR  [TSSOP-20_L6.5-W4.4-P0.65-LS6.4-BL]  40.51 43.09 270 top
U6  XDSM-0240-2183B  [SIM-SMD_XDSM-0240-2183B]  8.13 13.5 270 top
U7  GT-USB-7010ASV  [USB-C-SMD_G-SWITCH_GT-USB-7010ASV]  60.83 34.96 270 bottom
U8  BQ24090DGQR  [MSOP-10_L3.0-W3.0-P0.50-LS5.0-BL-EP]  54.61 7.15 90 top
U14  A7680C-LANV  [LCC-LAG_L17.6-W15.7_A7680C]  24.51 30.01 0 bottom

## Footprints (pads in the part's own frame, mm; a bottom-side part is the same pattern mirrored in y, then rotated)
C0603
  rect 0.8x0.9 smd: 1(-0.7,0) 2(0.7,0)
CAP-SMD_L7.3-W4.3-FD
  rect 2.185x2.592 smd: 1(-3.437,0) 2(3.437,0)
CONN-SMD_2P-P2.00_PH2.0-SPWB
  rect 0.9x1.7 smd: 1(1,-3.175) 2(-1,-3.175)
  rect 0.8x3 smd: 3(-3.25,3.175) 4(3.25,3.175)
HDR-TH_2P-P2.54-V-M-1
  rect 1.8x1.8 hole 1.1: 1(-1.27,0)
  round 1.8 hole 1.1: 2(1.27,0)
HDR-TH_4P-P2.54-V-M
  rect 1.7x1.7 hole 1.1: 1(-3.81,0)
  round 1.7 hole 1.1: 2(-1.27,0) 3(1.27,0) 4(3.81,0)
HDR-TH_8P-P2.54-V-M
  rect 1.5x1.5 hole 1: 1(-8.89,0)
  round 1.5 hole 1: 2(-6.35,0) 3(-3.81,0) 4(-1.27,0) 5(1.27,0) 6(3.81,0) 7(6.35,0) 8(8.89,0)
HDR-TH_18P-P2.54-V-F-R2-C9-S2.54-1
  rect 1.7x1.7 hole 1.1: 1(-10.16,-1.27)
  round 1.7 hole 1.1: 2(-10.16,1.27) 3(-7.62,-1.27) 4(-7.62,1.27) 5(-5.08,-1.27) 6(-5.08,1.27) 7(-2.54,-1.27) 8(-2.54,1.27) 9(0,-1.27) 10(0,1.27) 11(2.54,-1.27) 12(2.54,1.27) 13(5.08,-1.27) 14(5.08,1.27) 15(7.62,-1.27) 16(7.62,1.27) 17(10.16,-1.27) 18(10.16,1.27)
IPEX-SMD_4P-L1.7-W1.7-LS2.0-L-4
  rect 0.65x0.6 smd: 1(-1,0)
  rect 1.5x0.6 smd: 2(0.025,-1) 4(0.025,1)
  rect 0.65x0.5 smd: 3(1,0)
L1206
  rect 1.485x1.728 smd: 1(-1.593,0) 2(1.593,0)
LCC-LAG_L17.6-W15.7_A7680C
  oval 0.7x2 smd: 1(6.05,7.8) 2(4.95,7.8) 3(3.85,7.8) 4(2.75,7.8) 5(1.65,7.8) 6(0.55,7.8) 7(-0.55,7.8) 8(-1.65,7.8) 9(-2.75,7.8) 10(-3.85,7.8) 11(-4.95,7.8) 12(-6.05,7.8) 22(-6.05,-7.8) 23(-4.95,-7.8) 24(-3.85,-7.8) 25(-2.75,-7.8) 26(-1.65,-7.8) 27(-0.55,-7.8) 28(0.55,-7.8) 29(1.65,-7.8) 30(2.75,-7.8) 31(3.85,-7.8) 32(4.95,-7.8) 33(6.05,-7.8)
  oval 2x0.7 smd: 13(-8.75,4.4) 14(-8.75,3.3) 15(-8.75,2.2) 16(-8.75,1.1) 17(-8.75,0) 18(-8.75,-1.1) 19(-8.75,-2.2) 20(-8.75,-3.3) 21(-8.75,-4.4) 34(8.75,-4.4) 35(8.75,-3.3) 36(8.75,-2.2) 37(8.75,-1.1) 38(8.75,0) 39(8.75,1.1) 40(8.75,2.2) 41(8.75,3.3) 42(8.75,4.4)
  rect 0.9x1.1 smd: 43(4.9,5.35) 44(3.5,5.35) 45(2.1,5.35) 46(0.7,5.35) 47(-0.7,5.35) 48(-2.1,5.35) 49(-3.5,5.35) 50(-4.9,5.35) 58(-4.9,-5.35) 59(-3.5,-5.35) 60(-2.1,-5.35) 61(-0.7,-5.35) 62(0.7,-5.35) 63(2.1,-5.35) 64(3.5,-5.35) 65(4.9,-5.35) 73(4.2,3.65) 74(2.8,3.65) 75(1.4,3.65) 76(0,3.65) 77(-1.4,3.65) 78(-2.8,3.65) 79(-4.2,3.65) 80(-4.2,-3.65) 81(-2.8,-3.65) 82(-1.4,-3.65) 83(0,-3.65) 84(1.4,-3.65) 85(2.8,-3.65) 86(4.2,-3.65)
  rect 1.1x0.9 smd: 51(-6.3,4.2) 52(-6.3,2.8) 53(-6.3,1.4) 54(-6.3,0) 55(-6.3,-1.4) 56(-6.3,-2.8) 57(-6.3,-4.2) 66(6.3,-4.2) 67(6.3,-2.8) 68(6.3,-1.4) 69(6.3,0) 70(6.3,1.4) 71(6.3,2.8) 72(6.3,4.2)
  custom 2.6x2.1 smd: 87(3,1.25)
  rect 2.6x2.1 smd: 88(0,1.25) 89(-3,1.25) 90(-3,-1.25) 91(0,-1.25) 92(3,-1.25)
MSOP-10_L3.0-W3.0-P0.50-LS5.0-BL-EP
  oval 0.28x1.62 smd: 1(-1,-2.11) 2(-0.5,-2.11) 3(0,-2.11) 4(0.5,-2.11) 5(1,-2.11) 6(1,2.11) 7(0.5,2.11) 8(0,2.11) 9(-0.5,2.11) 10(-1,2.11)
  rect 2.1x1.83 smd: 11(0,0)
R0603
  rect 0.806x0.864 smd: 1(-0.753,0) 2(0.753,0)
SIM-SMD_XDSM-0240-2183B
  rect 0.7x2.1 smd: 1(-6.5,5.242) 9(6.5,5.242) 10(-6.5,-6.758) 11(6.5,-6.758)
  rect 0.8x1.13 smd: C1(0.25,6.758) C2(-2.29,6.758) C3(-4.83,6.758) C5(1.52,6.758) C6(-1.02,6.758) C7(-3.56,6.758)
  rect 0.7x1.13 smd: CD(2.47,6.758)
SOT-23-5_L3.0-W1.7-P0.95-LS2.8-BL
  rect 0.49x1.157 smd: 1(-0.95,-1.153) 2(0,-1.153) 3(0.95,-1.153)
  rect 0.49x1.175 smd: 4(0.95,1.153) 5(-0.95,1.153)
SW-TH_G-SWITCH_SK-12F04-G050
  round 1.8 hole 1.2: 1(-3,0) 2(0,0) 3(3,0)
TF-SMD_TF-CARD-H1.8
  rect 0.7x1.6 smd: 1(2.25,5.05) 2(1.15,5.05) 3(0.05,5.05) 4(-1.05,5.05) 5(-2.15,5.05) 6(-3.25,5.05) 7(-4.35,5.05) 8(-5.45,5.05) 9(-6.55,5.05)
  rect 1.2x1.4 smd: 10(-7.747,4.55)
  rect 1.2x2.2 smd: 11(-7.75,-5.05) 12(7.75,-5.05)
  rect 1.6x1.4 smd: 13(6.85,4.55)
tp05R
  round 0.5 smd: 1(0,0)
TQFN-16_L3.0-W3.0-P0.50-BL-EP1.5
  rect 0.25x0.6 smd: 1(-0.749,-1.5) 2(-0.248,-1.5) 3(0.252,-1.5) 4(0.751,-1.5) 9(0.75,1.5) 10(0.25,1.5) 11(-0.25,1.5) 12(-0.749,1.5)
  rect 0.6x0.25 smd: 5(1.5,-0.748) 6(1.5,-0.248) 7(1.5,0.252) 8(1.5,0.752) 13(-1.5,0.752) 14(-1.5,0.252) 15(-1.5,-0.248) 16(-1.5,-0.748)
  rect 1.5x1.5 smd: 17(0,0)
TSSOP-20_L6.5-W4.4-P0.65-LS6.4-BL
  oval 0.364x1.742 smd: 1(-2.925,-2.871) 2(-2.275,-2.871) 3(-1.625,-2.871) 4(-0.975,-2.871) 5(-0.325,-2.871) 6(0.325,-2.871) 7(0.975,-2.871) 8(1.625,-2.871) 9(2.275,-2.871) 10(2.925,-2.871) 11(2.925,2.871) 12(2.275,2.871) 13(1.625,2.871) 14(0.975,2.871) 15(0.325,2.871) 16(-0.325,2.871) 17(-0.975,2.871) 18(-1.625,2.871) 19(-2.275,2.871) 20(-2.925,2.871)
USB-C-SMD_G-SWITCH_GT-USB-7010ASV
  oval 1x2.1 hole 0.6x1.7: 1(-4.32,1.78) 2(4.32,1.78)
  oval 1x1.8 hole 0.6x1.4: 3(4.32,-2.4) 4(-4.32,-2.4)
  rect 0.6x1.24 smd: A1B12(-3.2,2.4) A4B9(-2.4,2.4) B1A12(3.2,2.4) B4A9(2.4,2.4)
  rect 0.3x1.24 smd: A5(-1.25,2.4) A6(-0.25,2.4) A7(0.25,2.4) A8(1.25,2.4) B5(1.75,2.4) B6(0.75,2.4) B7(-0.75,2.4) B8(-1.75,2.4)
WIRELM-SMD_ESP32-S3-WROOM-1U
  rect 1.5x0.9 smd: 1(-8.75,8.895) 2(-8.75,7.625) 3(-8.75,6.355) 4(-8.75,5.085) 5(-8.75,3.815) 6(-8.75,2.545) 7(-8.75,1.275) 8(-8.75,0.005) 9(-8.75,-1.265) 10(-8.75,-2.535) 11(-8.75,-3.805) 12(-8.75,-5.075) 13(-8.75,-6.345) 14(-8.75,-7.615) 27(8.75,-7.615) 28(8.75,-6.345) 29(8.75,-5.075) 30(8.75,-3.805) 31(8.75,-2.535) 32(8.75,-1.265) 33(8.75,0.005) 34(8.75,1.275) 35(8.75,2.545) 36(8.75,3.815) 37(8.75,5.085) 38(8.75,6.355) 39(8.75,7.625) 40(8.75,8.895)
  rect 0.9x1.5 smd: 15(-6.985,-8.895) 16(-5.715,-8.895) 17(-4.445,-8.895) 18(-3.175,-8.895) 19(-1.905,-8.895) 20(-0.635,-8.895) 21(0.635,-8.895) 22(1.905,-8.895) 23(3.175,-8.895) 24(4.445,-8.895) 25(5.715,-8.895) 26(6.985,-8.865)
  rect 0.9x0.9 smd: 41(-2.9,-0.225) 41(-2.9,1.175) 41(-2.9,2.575) 41(-1.5,-0.225) 41(-1.5,1.175) 41(-1.5,2.575) 41(-0.1,-0.225) 41(-0.1,1.175) 41(-0.1,2.575)
WQFN-20_L3.0-W3.0-P0.50-TL-EP1.4
  rect 0.7x0.25 smd: 1(-1.45,0.751) 2(-1.45,0.252) 3(-1.45,-0.248) 4(-1.45,-0.749) 11(1.45,-0.749) 12(1.45,-0.248) 13(1.45,0.252) 14(1.45,0.751)
  custom 0.575x0.601 smd: 5(-1.412,-1.399) 10(1.411,-1.399)
  rect 0.25x0.7 smd: 6(-0.75,-1.452) 7(-0.25,-1.452) 8(0.25,-1.452) 9(0.75,-1.452) 16(0.75,1.452) 17(0.25,1.452) 18(-0.25,1.452) 19(-0.75,1.452)
  custom 0.577x0.599 smd: 15(1.413,1.402) 20(-1.41,1.401)
  rect 1.4x1.4 smd: 21(0,0.002)

## Nets
As in the schematic.

Pads without a net: CN2 3 4; H1 3 4; LDO1 4; SW1 1; TF1 1 8 9; U1 16 26 28 29 30; U3 5 6 12 13; U4 11; U5 9 12; U6 C6; U7 A8 B8; U8 5 6; U14 3 4 5 6 22 23 28 38 41 42 43 44 45 46 47 48 49 50 51 52 53 54 55 56 57 60 61 62 63 64 65 66 67 68 69 70 71 72 73 74 75 76 77 78 79 80 81 82 83 84 85 86

## Via types
v1: diameter 0.61, hole 0.305, Top Layer to Bottom Layer, 74 vias
v2: diameter 3, hole 2.5, Top Layer to Bottom Layer, 2 vias
v3: diameter 0.61, hole 0.4, Top Layer to Bottom Layer, 1 via

## Routing (per net, layer and track width the routed paths; a pad name or vN(x,y) marks a point on that pad's centre or on a via; arc(x,y) is an arc through that point)
4.2V: length 152.1
  Top Layer w0.299: C81.1 52.5,4.75 U8.10 52.1,5.75 49.4,5.75 ; LDO1.1 37.4,15.09 37.72,15.41 38.99,15.41 39.3,15.09 LDO1.3
  Top Layer w0.5: 34.67,11.06 36.27,12.66 ; 36.27,12.66 37.4,13.79 LDO1.1 ; 36.27,12.66 43.17,5.75 49.4,5.75 ; C91.1 34.56,10.95
  Top Layer w0.75: 58.3,21.75 40,21.75 34.67,16.42 34.67,11.06 34.56,10.95 ; 58.3,21.75 v1(54.99,25.06) ; 58.3,21.75 SW1.2
  Inner1 w0.5: v1(27.29,58.7) 38.74,70.14 38.74,71.41 42.8,75.48 H3.2
  Bottom Layer w0.299: U3.7 U3.8
  Bottom Layer w0.5: U3.8 v1(27.29,58.7) C32.2 27.94,54.5 27.94,52.36 29.84,50.46 33.4,50.46 46.04,37.82 46.04,35.79 46.74,35.09 47.83,35.09 L144.2
  Bottom Layer w0.75: C141.2 50.95,25.06 v1(54.99,25.06)
  Bottom Layer w1: L144.2 L143.2 50.8,25.21 C141.2
GND: length 21.4
  Top Layer w0.254: U8.3 v1(54.61,7.15) 54.11,7.65 U8.7
  Bottom Layer w0.254: U3.3 U3.2 33.4,57.7 ; 33.4,57.7 v1(33.15,57.95) ; 33.4,57.7 v1(33.15,57.95) ; 33.4,57.7 U3.15 ; v1(33.15,57.95) 33.4,58.2 U3.11 ; U4.10 17.54,8.41 17.53,8.42 17.53,9.18 17.9,9.56 U4.12 19.66,9.56 v1(19.91,9.81) 20.66,10.56 U4.19 20.71,11.21 U4.20
  Bottom Layer w0.5: 63.5,47.93 63.5,43.15 C12.2
  vias: v1(15.21,56.12) v1(21.32,8.41) v1(21.51,31.26) v1(21.51,28.76) v1(24.51,31.26) v1(24.51,28.76) v1(27.51,31.26) v1(27.51,28.76) v1(37.15,64.26) v1(54.38,56.58) v1(54.38,55.18) v1(54.38,53.78) v1(55.78,56.58) v1(55.78,55.18) v1(55.78,53.78) v1(57.19,56.58) v1(57.19,55.18) v1(57.19,53.78) v2(2.69,33.54) v2(62.38,11.95)
VBUS: length 44.6
  Top Layer w0.254: U8.1 57.56,5.31 v1(59.69,5.31)
  Top Layer w0.5: v1(59.69,5.31) C83.1
  Bottom Layer w0.254: 59.82,36.61 59.07,37.36 U7.A4B9
  Bottom Layer w0.3: 59.56,33.06 59.19,32.69 58.43,32.69
  Bottom Layer w0.453: 60.45,35.85 60.45,35.98
  Bottom Layer w0.554: 60.45,33.95 60.45,35.85 ; 60.45,33.95 60.45,31.11 60.53,31.03 60.53,30.82 63.75,27.6 63.75,17.06 59.69,12.99 59.69,5.37 ; 60.45,33.95 59.56,33.06 ; 60.45,35.98 59.82,36.61
VCC: length 37.3
  Top Layer w0.254: U5.19 v1(41.02,45.37)
  Top Layer w0.5: C94.1 46.23,17.12 v3(46.04,17.31) ; v1(20.46,52.73) 19.7,52.73 18.54,53.89 15.24,53.89 TF1.4
  Bottom Layer w0.254: U4.16 19.19,11.29 v1(19.19,17.07) ; v1(10.37,8.78) C42.2 12.16,10.06 16.75,10.06 ; 16.75,10.06 16.7,10.01 v1(16.7,6.77) 17.57,6.77 18.63,7.83 18.9,7.83 19.07,7.99 19.07,8.26 U4.9 ; 16.75,10.06 U4.13
  Bottom Layer w0.5: v1(62.16,43.09) 62.24,43.16 U1.2
  vias: v1(57.38,41.54)
VDD_EXT: length 32.1
  Top Layer w0.254: U5.10 37.65,40.17 38.99,40.17 39.5,40.68 39.5,44.74 38.87,45.37 U5.2 v1(34.54,45.37)
  Inner1 w0.254: v1(33.26,27.81) 33.26,44.08 v1(34.54,45.37)
  Bottom Layer w0.5: C51.1 35.84,27.81 v1(33.26,27.81)
ADC_DIN: length 61.7
  Inner2 w0.254: v1(21.08,7.4) 23.5,7.4 38.61,22.52 45.85,22.52 49.28,25.95 49.28,37.76 55.88,44.37 v1(55.88,47.93)
  Bottom Layer w0.254: U4.6 20.7,8.32 20.7,7.78 v1(21.08,7.4)
DAC_DIN: length 27.6
  Inner1 w0.254: v1(57.16,47.93) 55.14,49.95 50.42,49.95 46.35,54.01 v1(34.93,54.01)
  Bottom Layer w0.254: U3.1 34.93,55.42 v1(34.93,54.01)
DAC_MODE: length 19.7
  Bottom Layer w0.254: U1.15 37.34,49.69 32.74,54.29 R31.2 32.4,55.93 U3.4
EXT_PIN1: length 130.6
  Top Layer w0.254: H3.5 48.01,71.41 47.12,70.52 31.12,70.52 29.34,72.3 LCD.4
  Inner1 w0.5: H1.6 29.21,21.46 25.45,25.22 25.45,38.34 23.88,39.92 23.88,63.54 29.34,69 LCD.4
  Bottom Layer w0.254: H3.5 48.01,71.28 47.57,70.85 44.81,70.85 40.18,66.23 40.18,65.15 40.21,65.12 40.21,59.92 43.21,56.93 43.21,54.12 43.69,53.64 43.69,53.12 44.58,52.23 U1.17
EXT_PIN2: length 132.2
  Top Layer w0.254: H3.6 46.66,74.13 46.66,71.72 46.48,71.54 33.02,71.54 31.88,72.68 LCD.3
  Inner1 w0.5: H1.5 31.75,33.31 25.27,39.79 25.27,62.39 31.88,69 LCD.3
  Bottom Layer w0.254: 45.72,53.5 44.32,53.5 43.56,54.27 43.56,57.07 40.56,60.07 40.56,65.27 40.54,65.3 40.54,66.08 44.96,70.5 48.49,70.5 49.28,71.28 49.28,74.21 H3.6
EXT_PIN3: length 27.7
  Bottom Layer w0.254: H3.7 50.55,70.65 50.04,70.14 45.1,70.14 40.92,65.96 40.92,65.72 40.89,65.7 40.89,65.44 40.92,65.42 40.92,60.22 43.94,57.2 43.94,55.41 44.58,54.78 U1.19
EXT_PIN4: length 30.3
  Bottom Layer w0.254: H3.8 51.94,74.08 51.94,71.03 50.62,69.71 45.18,69.71 41.28,65.81 41.28,61.51 42.85,59.93 42.85,58.79 44.45,57.19 44.45,56.05 44.63,55.87 45.54,55.87 U1.20
EXT_PIN5: length 25.7
  Bottom Layer w0.254: H3.9 53.09,71.67 50.78,69.36 45.32,69.36 41.73,65.76 41.73,61.57 43.21,60.1 43.21,59.96 44.45,58.72 44.45,57.7 44.83,57.31 U1.21
EXT_PIN6: length 27.9
  Bottom Layer w0.254: 45.72,58.58 45.09,58.58 43.56,60.11 43.56,60.25 42.09,61.72 42.09,65.62 45.42,68.95 46.31,68.95 46.35,69 50.94,69 52.69,70.75 53.19,70.75 54.36,71.92 54.36,74.21 H3.10
EXT_PIN7: length 24.8
  Bottom Layer w0.254: H3.11 55.63,71.49 54.54,70.4 52.84,70.4 51.03,68.59 45.57,68.59 44.33,67.35 44.32,67.35 44.14,67.17 44.14,67.16 42.44,65.46 42.44,61.87 43.54,60.77 43.99,60.77 44.91,59.86 U1.23
EXT_PIN8: length 28.1
  Bottom Layer w0.254: U1.24 43.69,61.12 42.8,62.01 42.8,65.32 45.72,68.24 51.18,68.24 52.9,69.96 55.9,69.96 56.9,70.96 56.9,74.21 H3.12
EXT_PIN9: length 24.1
  Bottom Layer w0.254: U1.25 43.69,62.39 43.51,62.57 43.51,65.01 45.97,67.47 51.44,67.47 53.34,69.38 57.15,69.38 58.17,70.4 H3.13
EXT_PIN10: length 16.3
  Bottom Layer w0.254: U1.31 52.07,66.84 54.18,68.94 58.62,68.94 59.56,69.89 59.56,74.08 H3.14
EXT_PIN11: length 13
  Bottom Layer w0.254: 53.34,65.43 53.34,66.58 55.13,68.36 59.31,68.36 60.71,69.76 H3.15
EXT_PIN12: length 16.2
  Bottom Layer w0.254: U1.33 54.62,66.72 55.75,67.86 60.07,67.86 61.98,69.76 61.98,74.21 H3.16
EXT_PIN13: length 12.8
  Bottom Layer w0.254: 55.88,65.43 55.88,65.44 55.88,66.84 56.47,67.43 60.28,67.43 63.25,70.4 H3.17
EXT_PIN14: length 11.5
  Bottom Layer w0.254: H3.18 63.3,75.48 64.44,74.33 64.44,71.08 62.24,68.88 U1.39
GSM_KEY: length 10.5
  Top Layer w0.254: U5.16 48.33,43.42 50.8,45.89 50.8,47.92 v1(50.81,47.93)
GSM_OUT+: length 10.2
  Bottom Layer w0.254: C48.2 23.88,16.8 19.69,20.99 19.69,22.09 U14.11
GSM_OUT-: length 2.9
  Bottom Layer w0.254: C49.2 18.46,20.66 U14.12
GSM_RI: length 12.8
  Top Layer w0.254: U5.15 50.22,42.77 52.07,44.61 52.07,47.92 v1(52.07,47.93)
GSM_RST: length 8.8
  Top Layer w0.254: U5.17 47.46,44.07 49.53,46.14 49.53,47.92 v1(49.53,47.93)
GSM_RX: length 14.8
  Top Layer w0.254: U5.14 51.73,42.12 53.34,43.73 53.34,47.92 v1(53.34,47.93)
GSM_TX: length 16.7
  Top Layer w0.254: v1(54.62,47.93) 54.61,47.92 54.61,43.22 52.86,41.47 U5.13
GSM_VDD: length 24.1
  Bottom Layer w0.711: L142.1 38.98,34.41 ; 38.98,34.41 U14.34 U14.35 ; 38.98,34.41 41.6,34.41 C142.2
  Bottom Layer w0.75: C144.1 C143.1 41.26,25.77 L141.1
  Bottom Layer w1.016: L141.1 L142.1
I2S_BCK: length 96.7
  Inner1 w0.254: v1(36.45,57.2) 45.58,57.2 51.94,50.84 56.51,50.84 58.43,48.93 v1(58.43,47.93)
  Inner2 w0.254: v1(58.43,47.93) 58.42,47.92 58.42,45.5 50.42,37.5 50.42,23.15 48.13,20.87 38.48,20.87 24.13,6.51 v1(19.18,6.51)
  Bottom Layer w0.254: U3.16 v1(36.45,57.2) ; U4.7 20.16,7.5 v1(19.18,6.51)
I2S_LRC: length 103
  Inner1 w0.254: v1(36.45,58.2) 46.23,58.2 52.71,51.73 57.02,51.73 59.69,49.06 v1(59.69,47.93)
  Inner2 w0.254: v1(59.69,47.93) 59.69,47.92 59.69,45.63 52.96,38.9 52.96,22.9 49.91,19.85 38.86,19.85 24.51,5.5 18.8,5.5 v1(18.03,6.26)
  Bottom Layer w0.254: U3.14 v1(36.45,58.2) ; U4.8 19.66,7.89 v1(18.03,6.26)
MDM_DBG_RX: length 23.6
  Top Layer w0.254: U5.3 37.62,44.74 25.15,44.74 21.01,40.61 v1(21.01,35.36)
MDM_DBG_TX: length 25.7
  Top Layer w0.254: v1(19.61,35.36) 19.61,40.86 24.76,46.01 37.64,46.01 U5.1
MDM_KEY: length 22.3
  Top Layer w0.254: U5.5 35.38,43.42 34.04,42.08 v1(34.04,40.55)
  Bottom Layer w0.254: v1(34.04,40.55) 31.75,38.27 31.75,29.5 32.34,28.91 U14.39 33.3,28.87 34.8,28.87 35.43,29.5 C145.2
MDM_RI: length 27.3
  Top Layer w0.254: v1(23.96,22.21) 34.8,33.05 34.8,41.69 35.87,42.77 U5.6
MDM_RST: length 19.2
  Top Layer w0.254: U5.4 34.88,44.07 33.4,42.58 33.4,37.12 31.82,35.55 28.37,35.55 26.16,37.76 v1(26.16,37.81)
MDM_RX: length 24
  Top Layer w0.254: U5.7 36.36,42.12 35.43,41.19 35.43,28.18 v1(29.46,22.21)
MDM_TX: length 22.8
  Top Layer w0.254: v1(30.56,22.21) 36.07,27.72 36.07,40.93 36.41,41.28 36.79,41.28 36.98,41.47 U5.8
MIC_OUT+: length 22.3
  Top Layer w0.254: v1(23.11,11.09) 24.36,11.09 29.58,5.87
  Inner1 w0.254: v1(23.11,11.09) 21.76,12.44 v1(21.76,22.21)
  Bottom Layer w0.254: U4.1 22.59,10.56 v1(23.11,11.09)
MIC_OUT-: length 22
  Top Layer w0.254: v1(23.37,10.2) 26.91,6.66 26.91,5.61
  Inner1 w0.254: v1(23.37,10.2) 23.24,10.07 22.35,10.07 20.66,11.76 v1(20.66,22.21)
  Bottom Layer w0.254: v1(23.37,10.2) 23.23,10.06 U4.2
SD_CS: length 65
  Top Layer w0.254: v1(57.16,65.43) 57.16,66.34 57.78,66.97 61.72,66.97 62.48,66.2 62.48,61.76 61.85,61.12 57.15,61.12 44.96,48.93 18.67,48.93 15.88,51.72 v1(15.21,51.72)
SD_MISO: length 47.1
  Inner2 w0.254: v1(58.43,65.43) 50.22,57.22 39.4,57.22 38.8,56.62 33.34,56.62 32.73,57.22 v1(15.21,57.22)
SD_MOSI: length 53.4
  Top Layer w0.254: v1(59.69,65.43) 59.74,65.38 59.74,63.59 59.56,63.41 57.53,63.41 43.81,49.69 20.32,49.69 17.19,52.82 v1(15.21,52.82)
SD_SCK: length 50.1
  Inner2 w0.254: v1(15.21,55.02) 50.56,55.02 v1(60.97,65.43)
SIM_CD: length 25.8
  Top Layer w0.254: v1(7.11,21.75) 7.11,16.8 12.88,11.03 U6.CD
  Bottom Layer w0.254: v1(7.11,21.75) 9.78,24.42 12.45,24.42 14.73,26.71 U14.14
SIM_CLK: length 15.5
  Top Layer w0.254: v1(13.34,27.85) 13.34,24.42 11.81,22.9 11.81,19.34 12.7,18.45 14.76,18.45 U6.C3
  Bottom Layer w0.254: U14.16 14.39,28.91 v1(13.34,27.85)
SIM_DAT: length 17
  Top Layer w0.254: U6.C7 12.06,17.06 10.67,18.45 10.67,23.91 v1(12.57,25.82)
  Bottom Layer w0.254: U14.15 14.56,27.81 v1(12.57,25.82)
SIM_RST: length 21.8
  Top Layer w0.254: U6.C2 12.06,15.79 9.65,18.2 9.65,26.07 v1(11.05,27.47)
  Bottom Layer w0.254: U14.17 13.59,30.01 v1(11.05,27.47)
SIM_VDD: length 30.4
  Top Layer w0.254: v1(9.4,28.99) 8.38,27.98 ; 8.38,27.98 8.38,17.56 12.57,13.37 14.76,13.37 U6.C1 ; 8.38,27.98 C61.1
  Bottom Layer w0.254: v1(9.4,28.99) 11.51,31.11 U14.18
USB_DN: length 19.4
  Bottom Layer w0.254: 48.26,47.93 48.26,45.12 57.67,35.71 U7.B7 58.5,35.64 59.17,35.64 59.33,35.48 59.33,34.95 59.17,34.78 58.5,34.78 U7.A7
USB_DP: length 19.8
  Bottom Layer w0.254: 57.53,34.98 57.7,35.14 58.36,35.14 U7.A6 ; 57.53,34.98 57.53,34.45 57.7,34.28 58.36,34.28 U7.B6 ; 57.53,34.98 47,45.52 U1.14
$1N627: length 3.2
  Bottom Layer w0.254: U4.3 24.51,9.56 R41.2
$1N640: length 3.9
  Bottom Layer w0.254: U4.4 21.36,9.06 22.22,9.06 22.86,8.42 23.38,8.42 24.52,7.28
$1N1240: length 3.8
  Bottom Layer w0.254: 21.48,14.53 20.16,13.21 U4.18
$1N1281: length 4.8
  Bottom Layer w0.254: U4.17 19.66,15.13 20.33,15.8
$1N1917: length 14.3
  Bottom Layer w0.254: 26.42,59.47 26.44,59.45 U3.9
  Bottom Layer w0.5: 19.32,62.39 22.24,59.47 26.42,59.47
$1N1922: length 13.6
  Bottom Layer w0.299: 32.51,61.12 32.9,60.74 U3.10
  Bottom Layer w0.5: 32.51,61.12 31.24,62.39 21.32,62.39
$1N1987: length 3.5
  Bottom Layer w0.254: C43.2 17.42,11.59 17.93,11.09 17.93,10.79 18.09,10.63 18.39,10.63 U4.14
$1N3244: length 42.4
  Bottom Layer w0.254: R42.1 21.97,6.25 R44.2 18.55,3.59 8.76,3.59 5.46,6.9 5.46,17.18 7,18.72 C49.1
$1N3252: length 4.9
  Bottom Layer w0.254: C48.1 25.85,12.42 R43.1 26.03,12.21 R41.1
$3N2541: length 41.6
  Top Layer w0.5: TF1.10 14.71,60.62 TF1.11 5.11,58.68 5.61,58.17 5.61,49.45 5.11,48.94 TF1.12 13.81,45.12 TF1.13 18.31,46.02 R32.2
$3N4160: length 3.3
  Top Layer w0.254: 25.92,4.62 24.13,2.83 H1.8
$3N4212: length 3.6
  Top Layer w0.254: H1.7 28.59,3.99 28.59,4.88
$3N6525: length 8.4
  Top Layer w0.254: v1(60.97,47.93) 60.97,45.13 R84.2 58.44,42.92 RST.1
$3N6717: length 10.9
  Top Layer w0.254: v1(47,65.43) 39.68,65.43 ; 39.68,65.43 39.67,65.45 BOOT.1 ; 39.68,65.43 38.32,65.43 R85.1
$4N1300: length 42.8
  Top Layer w0.254: R61.2 2.16,6.21 U6.11 ; U6.11 U6.9 16,9.63 16,18.57 15.57,19.01 14.36,19.01 U6.1 ; U6.11 U6.10
$4N2254: length 3.2
  Bottom Layer w1.27: 44.45,29.59 L143.1
$4N2294: length 3.2
  Bottom Layer w1.27: 44.45,32.13 L144.1
$4N3518: length 2.9
  Bottom Layer w0.299: RF1.3 29.46,37.81 U14.32
$4N4563: length 9.3
  Bottom Layer w0.254: TP_BOOT.1 17.15,39.66 17.15,34.33 17.04,34.22 17.04,34.15 16.2,33.31 U14.20
$4N4643: length 3.8
  Bottom Layer w0.254: U14.24 20.66,40.13 TP_VBUS.1
$4N4664: length 3.8
  Bottom Layer w0.254: U14.25 21.76,40.03 TP_DP.1
$4N4685: length 3.8
  Bottom Layer w0.254: TP_DN.1 22.86,39.93 U14.26
$4N6666: length 3.5
  Top Layer w0.254: GSM_DBG_RX.1 46.8,44.72 U5.18
$4N6668: length 3.4
  Top Layer w0.254: GSM_DBG_TX.1 43.43,46.06 U5.20
$5N380: length 20.1
  Top Layer w0.75: U7.2 U7.3 63.23,39.28 59.05,39.28
  Bottom Layer w0.254: U7.2 57.56,29.15 R36.2
$5N1031: length 5.8
  Top Layer w0.254: U8.2 60.08,6.65 60.45,7.02 R82.2
$5N1617: length 5.3
  Top Layer w0.254: R81.2 48.38,6.65 U8.9
$5N1677: length 3.6
  Top Layer w0.254: U8.4 59.43,7.65 R83.2
$5N1951: length 7.5
  Top Layer w0.75: H2.1 61.96,18.71 SW1.3
$5N2171: length 10.2
  Top Layer w0.5: C93.1 42.86,14.51 L91.1 41.78,17.31 40.64,18.45 38.35,18.45 37.4,17.5 LDO1.5

## Copper pours and planes (outline as drawn; the poured copper is in the pictures)
GND on Top Layer: 0,77 65,77 65,0 0,0
GND on Bottom Layer: 0,77 65,77 65,0 0,0
VCC on Inner1: 0,77 65,77 65,0 0,0
VCC on Inner2: 0,77 65,77 65,0 0,0
